# Altium project PSLink_v1.PrjPcb (part 2 of 3)

## Sheet phase-shifters.SchDoc
size 420 x 297 mm; SheetNumber: 3; SheetTotal: 7
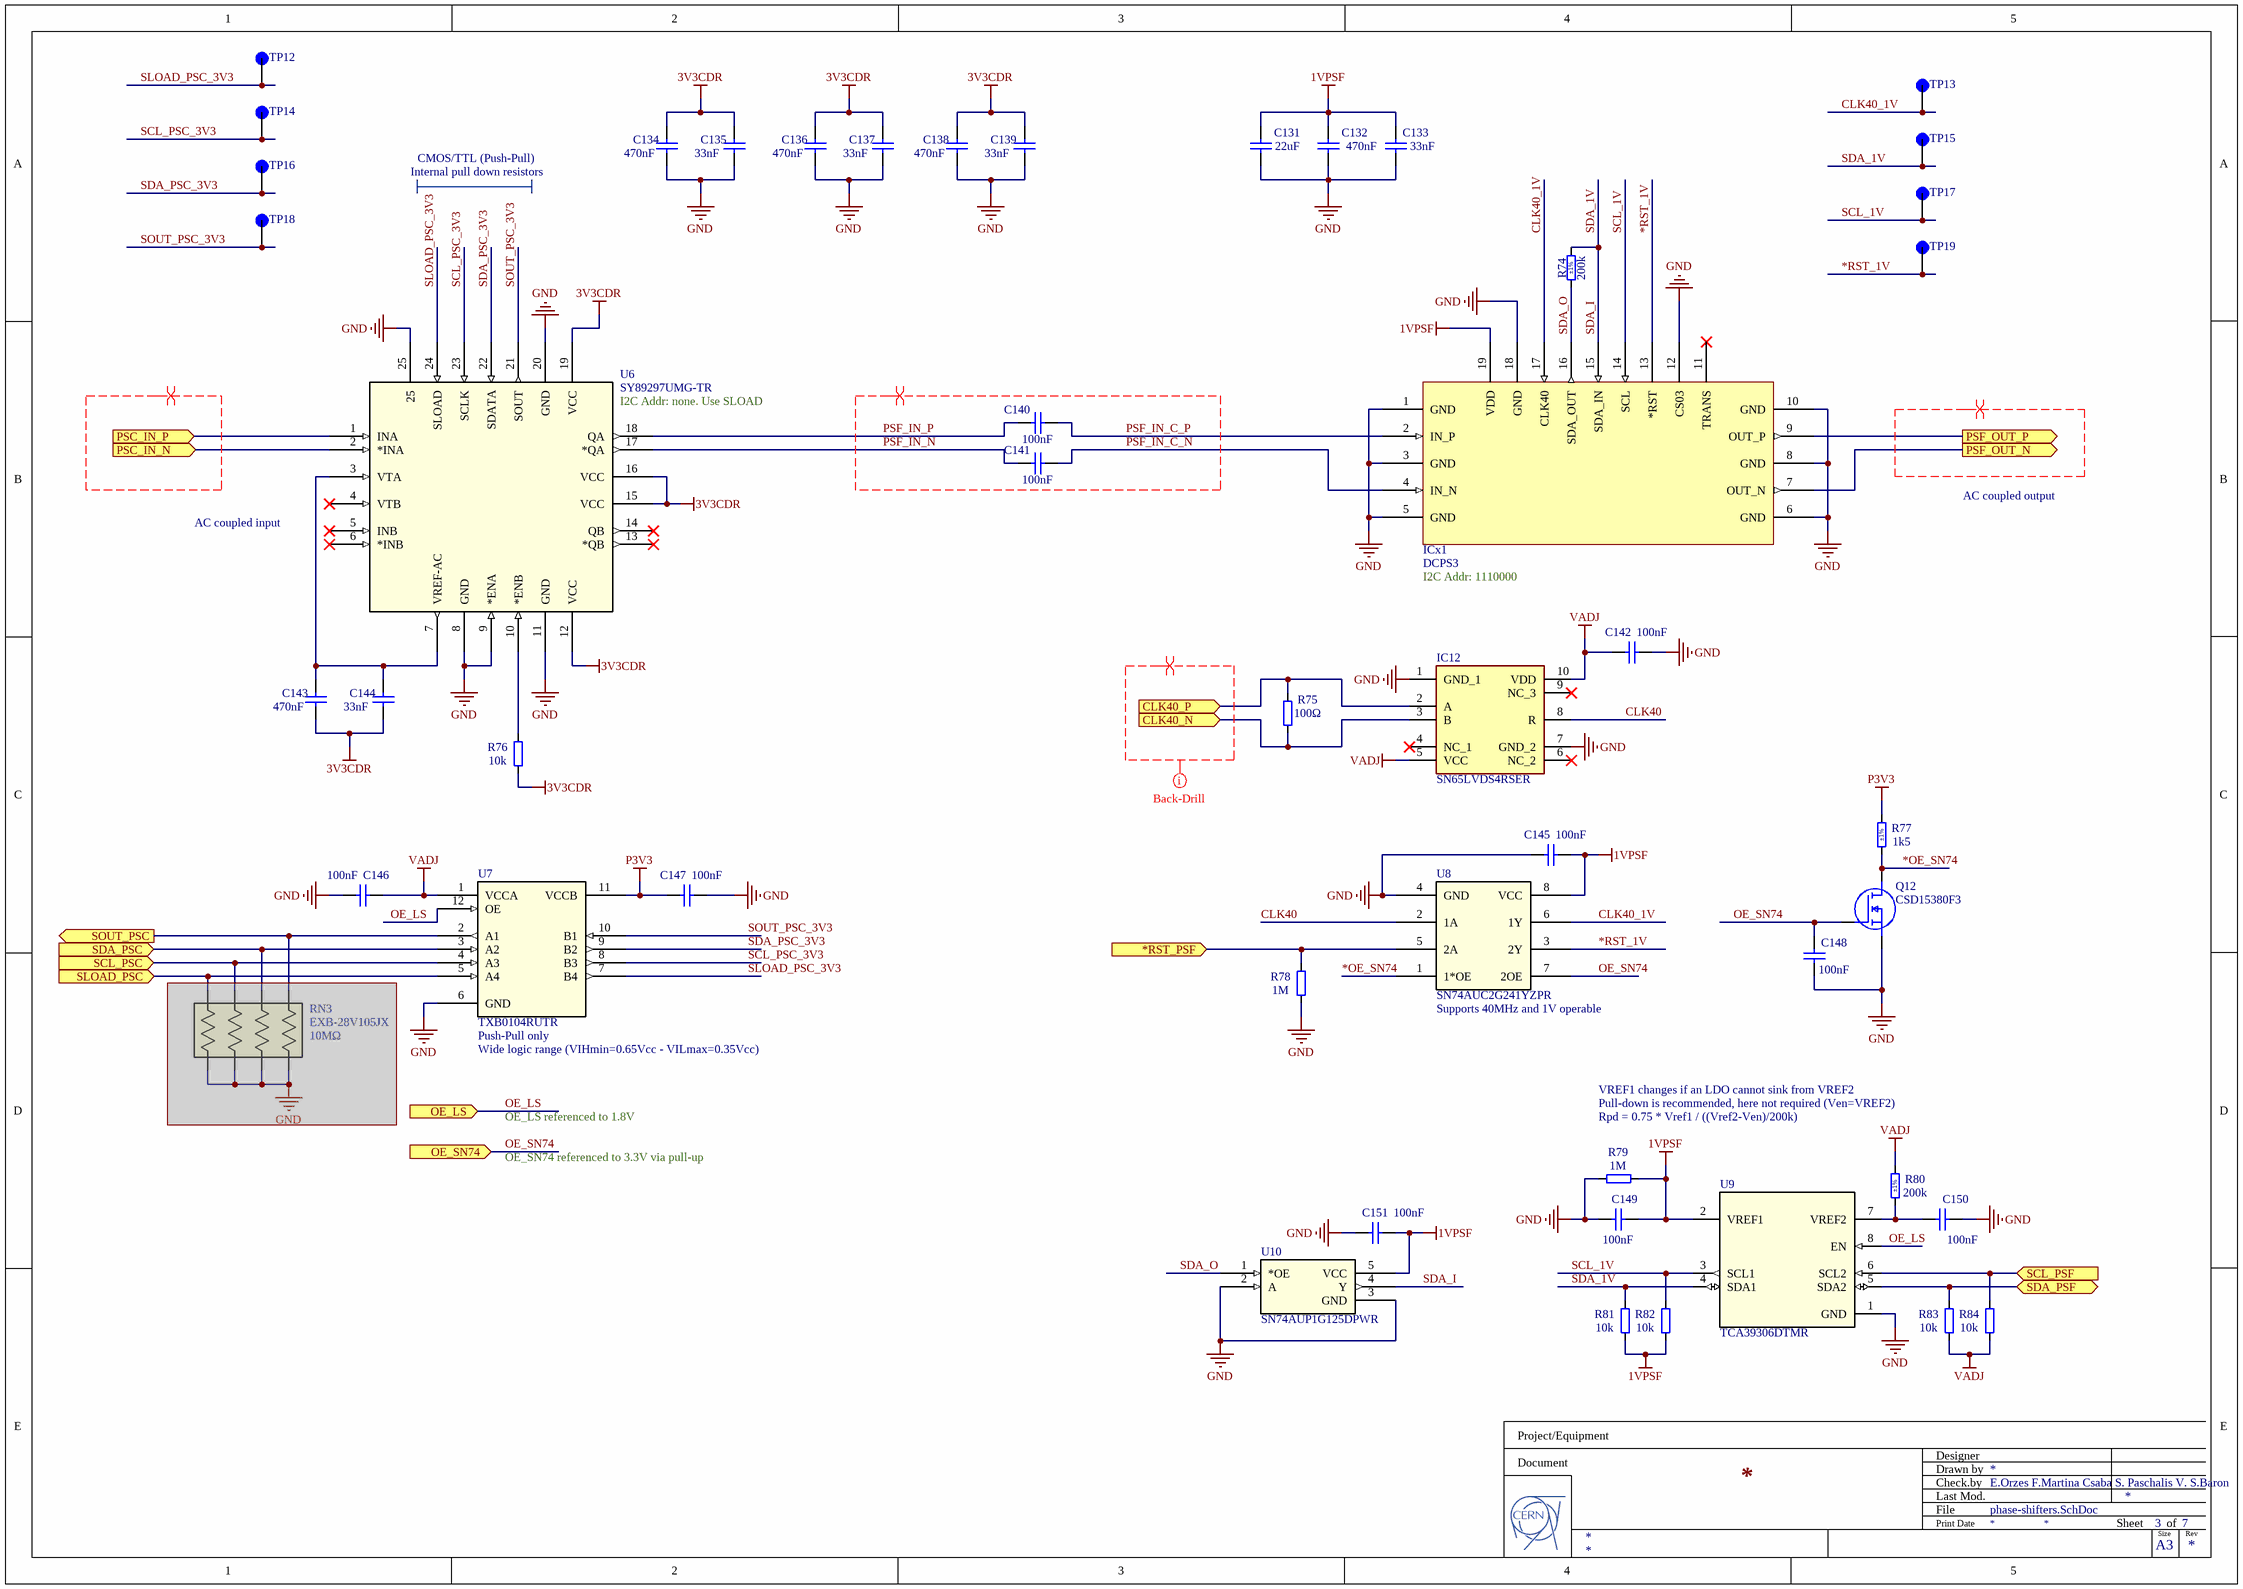
[diagram p3: phase-shifters.SchDoc]

### Parts
(Parts that share a designator on the sheet are numbered #1, #2 ... from top to bottom, then left to right.)
C131  22uF  [MURATA_HI_DENSITY_0402_CAP]
C132  470nF  [CAPC0510X04N]
C133  33nF  [LLL03TR61E333KE01]
C134  470nF  [CAPC0510X04N]
C135  33nF  [LLL03TR61E333KE01]
C136  470nF  [CAPC0510X04N]
C137  33nF  [LLL03TR61E333KE01]
C138  470nF  [CAPC0510X04N]
C139  33nF  [LLL03TR61E333KE01]
C140  100nF  [MURATA_HI_DENSITY_0201]
C141  100nF  [MURATA_HI_DENSITY_0201]
C142  100nF  [MURATA_HI_DENSITY_0201]
C143  470nF  [CAPC0510X04N]
C144  33nF  [LLL03TR61E333KE01]
C145  100nF  [MURATA_HI_DENSITY_0201]
C146  100nF  [MURATA_HI_DENSITY_0201]
C147  100nF  [MURATA_HI_DENSITY_0201]
C148  100nF  [MURATA_HI_DENSITY_0201]
C149  100nF  [MURATA_HI_DENSITY_0201]
C150  100nF  [MURATA_HI_DENSITY_0201]
C151  100nF  [MURATA_HI_DENSITY_0201]
IC12  SN65LVDS4RSER  [SN65LVDS4RSER]
ICx1  DCPS3  [DCPS3-Large]
Q12  CSD15380F3  [CSD15380F3]
R74  200k  Tolerance: ±1%  [RESC1005X40N]
R75  100Ω  [MURATA_HI_DENSITY_0201]
R76  10k  [MURATA_HI_DENSITY_0201]
R77  1k5  Tolerance: ±1%  [RESC1005X40N]
R78  1M  [MURATA_HI_DENSITY_0201]
R79  1M  [MURATA_HI_DENSITY_0201]
R80  200k  Tolerance: ±1%  [RESC1005X40N]
R81  10k  [MURATA_HI_DENSITY_0201]
R82  10k  [MURATA_HI_DENSITY_0201]
R83  10k  [MURATA_HI_DENSITY_0201]
R84  10k  [MURATA_HI_DENSITY_0201]
RN3#1  EXB-28V105JX  [EXB28V510JX]  (masked out: inside a compile mask, not in the netlist)
TP12  RCU-0C  [TP+195X110]  (value not drawn)
TP13  RCU-0C  [TP+195X110]  (value not drawn)
TP14  RCU-0C  [TP+195X110]  (value not drawn)
TP15  RCU-0C  [TP+195X110]  (value not drawn)
TP16  RCU-0C  [TP+195X110]  (value not drawn)
TP17  RCU-0C  [TP+195X110]  (value not drawn)
TP18  RCU-0C  [TP+195X110]  (value not drawn)
TP19  RCU-0C  [TP+195X110]  (value not drawn)
U6  SY89297UMG-TR  [QFN-24_MCH-L]
U7  TXB0104RUTR  [RUT12_TEX]
U8  SN74AUC2G241YZPR  [YZP8]
U9  TCA39306DTMR  [DTM0008A-MFG]
U10  SN74AUP1G125DPWR  [X2SON_TEX]

### Ports
*RST_PSF (in), CLK40_N (in), CLK40_P (in), OE_LS (in), OE_SN74 (in), PSC_IN_N (in), PSC_IN_P (in), PSF_OUT_N (out), PSF_OUT_P (out), SCL_PSC (in), SCL_PSF (in), SDA_PSC (in), SDA_PSF (bidir), SLOAD_PSC (in), SOUT_PSC (out)

### Nets
1VPSF: C131.2 C132.2 C133.2 C145.1 C149.1 C151.2 ICx1.19(VDD) R79.2 R81.1 R82.1 U8.8(VCC) U9.2(VREF1) U10.5(VCC)
3V3CDR: C134.2 C135.2 C136.2 C137.2 C138.2 C139.2 C143.1 C144.1 R76.1 U6.12(VCC) U6.15(VCC) U6.16(VCC) U6.19(VCC)
GND: C131.1 C132.1 C133.1 C134.1 C135.1 C136.1 C137.1 C138.1 C139.1 C142.1 C145.2 C146.1 C147.1 C148.2 C149.2 C150.1 C151.1 IC12.1(GND_1) IC12.7(GND_2) ICx1.1(GND) ICx1.3(GND) ICx1.5(GND) ICx1.6(GND) ICx1.8(GND) ICx1.10(GND) ICx1.12(CS03) ICx1.18(GND) Q12.2(S) R78.1 R79.1 U6.8(GND) U6.9(*ENA) U6.11(GND) U6.20(GND) U6.25 U7.6(GND) U8.4(GND) U9.1(GND) U10.2(A) U10.3(GND)
P3V3: C147.2 R77.2 U7.11(VCCB)
VADJ: C142.2 C146.2 IC12.5(VCC) IC12.10(VDD) R80.2 R83.1 R84.1 U7.1(VCCA)
*OE_SN74: Q12.3(D) R77.1 U8.1(1*OE)
*RST_1V: ICx1.13(*RST) TP19.1(TP) U8.3(2Y)
*RST_PSF: R78.2 U8.5(2A) ; port *RST_PSF
CLK40: IC12.8(R) U8.2(1A)
CLK40_1V: ICx1.17(CLK40) TP13.1(TP) U8.6(1Y)
CLK40_N: IC12.3(B) R75.1 ; port CLK40_N
CLK40_P: IC12.2(A) R75.2 ; port CLK40_P
FPGA_TX1_C_N: U6.2(*INA) ; port PSC_IN_N
FPGA_TX1_C_P: U6.1(INA) ; port PSC_IN_P
FPGA_TX1_PS_N: ICx1.7(OUT_N) ; port PSF_OUT_N
FPGA_TX1_PS_P: ICx1.9(OUT_P) ; port PSF_OUT_P
OE_LS: U7.12(OE) U9.8(EN) ; port OE_LS
OE_SN74: C148.1 Q12.1(G) U8.7(2OE) ; port OE_SN74
PSF_IN_C_N: C141.2 ICx1.4(IN_N)
PSF_IN_C_P: C140.2 ICx1.2(IN_P)
PSF_IN_N: C141.1 U6.17(*QA)
PSF_IN_P: C140.1 U6.18(QA)
SCL_1V: ICx1.14(SCL) R82.2 TP17.1(TP) U9.3(SCL1)
SCL_PSC: U7.4(A3) ; port SCL_PSC
SCL_PSC_3V3: TP14.1(TP) U6.23(SCLK) U7.8(B3)
SCL_PSF: R84.2 U9.6(SCL2) ; port SCL_PSF
SDA_1V: ICx1.15(SDA_IN) R74.2 R81.2 TP15.1(TP) U9.4(SDA1) U10.4(Y)  [also labelled SDA_I]
SDA_O: ICx1.16(SDA_OUT) R74.1 U10.1(*OE)
SDA_PSC: U7.3(A2) ; port SDA_PSC
SDA_PSC_3V3: TP16.1(TP) U6.22(SDATA) U7.9(B2)
SDA_PSF: R83.2 U9.5(SDA2) ; port SDA_PSF
SLOAD_PSC: U7.5(A4) ; port SLOAD_PSC
SLOAD_PSC_3V3: TP12.1(TP) U6.24(SLOAD) U7.7(B4)
SOUT_PSC: U7.2(A1) ; port SOUT_PSC
SOUT_PSC_3V3: TP18.1(TP) U6.21(SOUT) U7.10(B1)
NetC143_2: C143.2 C144.2 U6.3(VTA) U6.7(VREF-AC)
NetC150_2: C150.2 R80.1 U9.7(VREF2)
NetR76_2: R76.2 U6.10(*ENB)

Not connected (* = marked no-connect by the designer): IC12 4(NC_1)* 6(NC_2)* 9(NC_3)*; ICx1 11(TRANS)*; U6 4(VTB)* 5(INB)* 6(*INB)* 13(*QB)* 14(QB)*

### Layout directives
differential pair: (no net found under the mark), PSF_IN_C_N, PSF_IN_C_P, PSF_IN_N, PSF_IN_P
net class Back-Drill: (no net found under the mark)

### Notes on the sheet
- Internal pull down resistors
- CMOS/TTL (Push-Pull)
- (near U6) I2C Addr: none. Use SLOAD
- AC coupled input
- AC coupled output
- I2C Addr: 1110000
- (near RN3#1) 10MΩ
- (near U7) Push-Pull only
- (near U7) Wide logic range (VIHmin=0.65Vcc - VILmax=0.35Vcc)
- (near U8) Supports 40MHz and 1V operable
- OE_LS referenced to 1.8V
- Rpd = 0.75 * Vref1 / ((Vref2-Ven)/200k)
- VREF1 changes if an LDO cannot sink from VREF2
- Pull-down is recommended, here not required (Ven=VREF2)
- OE_SN74 referenced to 3.3V via pull-up
- Project/Equipment
- Document
- Designer
- Drawn by
- Check.by
- File
- Last Mod.
- Print Date
- Sheet
- Size
- A3
- of
- Rev

### Library data of the parts
C131 = C0402-22uF-high-density: GRM155R60J226ME11; Vmax: 6.3V; Value: 22uF
C132 C134 C136 C138 C143 = Capacitor - non polarized: LLL153C70G474ME17; Value: 470nF
C133 C135 C137 C139 C144 = Capacitor - non polarized: LLL03TR61E333KE01; Value: 33nF
C140-C142 C145-C151 = C0201-100nF-high-density: GRM033R61C104KE14; Vmax: 16V; Value: 100nF
IC12 = SN65LVDS4RSER: Integrated Circuit; Manufacturer_Name: Texas Instruments; Datasheet Link: http://www.ti.com/lit/gpn/SN65LVDS4; Height: 0.6mm; Manufacturer_Part_Number: SN65LVDS4RSER; Mouser Part Number: 595-SN65LVDS4RSER; Mouser Price/Stock: https://www.mouser.co.uk/ProductDetail/Texas-Instruments/SN65LVDS4RSER?qs=kO%2FAGeZgcF8xT3dfx7gx%252Bg%3D%3D; Arrow Part Number: SN65LVDS4RSER; Arrow Price/Stock: https://www.arrow.com/en/products/sn65lvds4rser/texas-instruments
Q12 = CSD15380F3: as Q1 on sheet power-sheet; Datasheet Link: https://www.ti.com/lit/ds/symlink/csd15380f3.pdf?ts=1641221366106&ref_url=https%253A%252F%252Fwww.google.com%252F; Height: 0.35mm; Manufacturer_Part_Number: CSD15380F3; Mouser Part Number: 595-CSD15380F3; Mouser Price/Stock: https://www.mouser.co.uk/ProductDetail/Texas-Instruments/CSD15380F3?qs=zEmsApcVOkXP46xhm0edmA%3D%3D; Arrow Part Number: CSD15380F3; Arrow Price/Stock: https://www.arrow.com/en/products/csd15380f3/texas-instruments?region=nac
R74 R80 = R0402_200K_1%_0.0625W_100PPM: as R24 on sheet power-sheet; Part Number: R0402_200K_1%_0.0625W_100PPM; Component Kind: Standard; Component Type: Standard; Pin Count: 2; Value: 200k; Status: Not Recommended; Power: 0.0625W; Manufacturer Part Number: R0402_200K_1%_0.0625W_100PPM; Case: 0402; Mounted: Yes; Sense: No; Socket: No; SMD: Yes; Manufacturer1 Example: YAGEO PHYCOMP; Manufacturer1 ComponentHeight: 0.4mm; HelpURL: \\cern.ch\dfs\Applications\Altium\Datasheets\R0402_Phycomp_RC0402.pdf; Author: CERN DEM JLC; CreateDate: 12/3/2007; LatestRevisionDate: 10/17/2012
R75 = R0201-100ohm-high-density: Resistor; Value: 100Ω
R76 R81-R84 = R0201-100ohm-high-density: Resistor 10k; Value: 100Ω
R77 = R0402_1K5_1%_0.0625W_100PPM: Resistor - 1%; Part Description: General Purpose Thick Film Chip Resistor; Manufacturer: GENERIC; Manufacturer1 Part Number: 232270671502L; TC: ±100ppm/°C; PressFit: No; Part Number: R0402_1K5_1%_0.0625W_100PPM; Component Kind: Standard; Component Type: Standard; Pin Count: 2; Value: 1k5; Status: Not Recommended; Power: 0.0625W; Manufacturer Part Number: R0402_1K5_1%_0.0625W_100PPM; Case: 0402; Mounted: Yes; Sense: No; Socket: No; SMD: Yes; Manufacturer1 Example: YAGEO PHYCOMP; Manufacturer1 ComponentHeight: 0.4mm; HelpURL: \\cern.ch\dfs\Applications\Altium\Datasheets\R0402_Phycomp_RC0402.pdf; Author: CERN DEM JLC; CreateDate: 12/3/2007; LatestRevisionDate: 10/17/2012
R78 R79 = R0201-100ohm-high-density: Resistor 1M; Value: 100Ω
RN3#1 = EXB-28V105JX: Resistor Network; Manufacturer_Name: Panasonic; Datasheet Link: https://componentsearchengine.com/Datasheets/1/EXB-28V105JX.pdf; Height: 0mm; Manufacturer_Part_Number: EXB-28V105JX; Mouser Part Number: 667-EXB-28V105JX; Mouser Price/Stock: https://www.mouser.co.uk/ProductDetail/Panasonic/EXB-28V105JX?qs=cttFivMKqWzpuYBrjCbkjA%3D%3D; Arrow Part Number: EXB-28V105JX; Arrow Price/Stock: https://www.arrow.com/en/products/exb-28v105jx/panasonic
TP12-TP19 = RCU-0C: as TP1 on sheet lane; Package: None; Price: None; Value: *; MP: RCU-0C; Availability: Unavailable
U6 = SY89297UMG-TR: Coarse Phase Shifter (5ps/5ns); Mfr_Name: Microchip; RefDes: RefDes; Type: Type
U7 = TXB0104RUTR: No Description Available; Mfr_Name: Texas Instruments; RefDes: RefDes; Type: Type
U8 = SN74AUC2G241YZPR: No Description Available; Mfr_Name: Texas Instruments; RefDes: RefDes; Type: Type
U9 = TCA39306DTMR: No Description Available; Mfr_Name: Texas Instruments; TYPE: TYPE; RefDes: RefDes
U10 = SN74AUP1G125DPWR: No Description Available; Mfr_Name: Texas Instruments; RefDes: RefDes; Type: Type

## Sheet SFP.SchDoc
size 420 x 297 mm; SheetNumber: 4; SheetTotal: 7
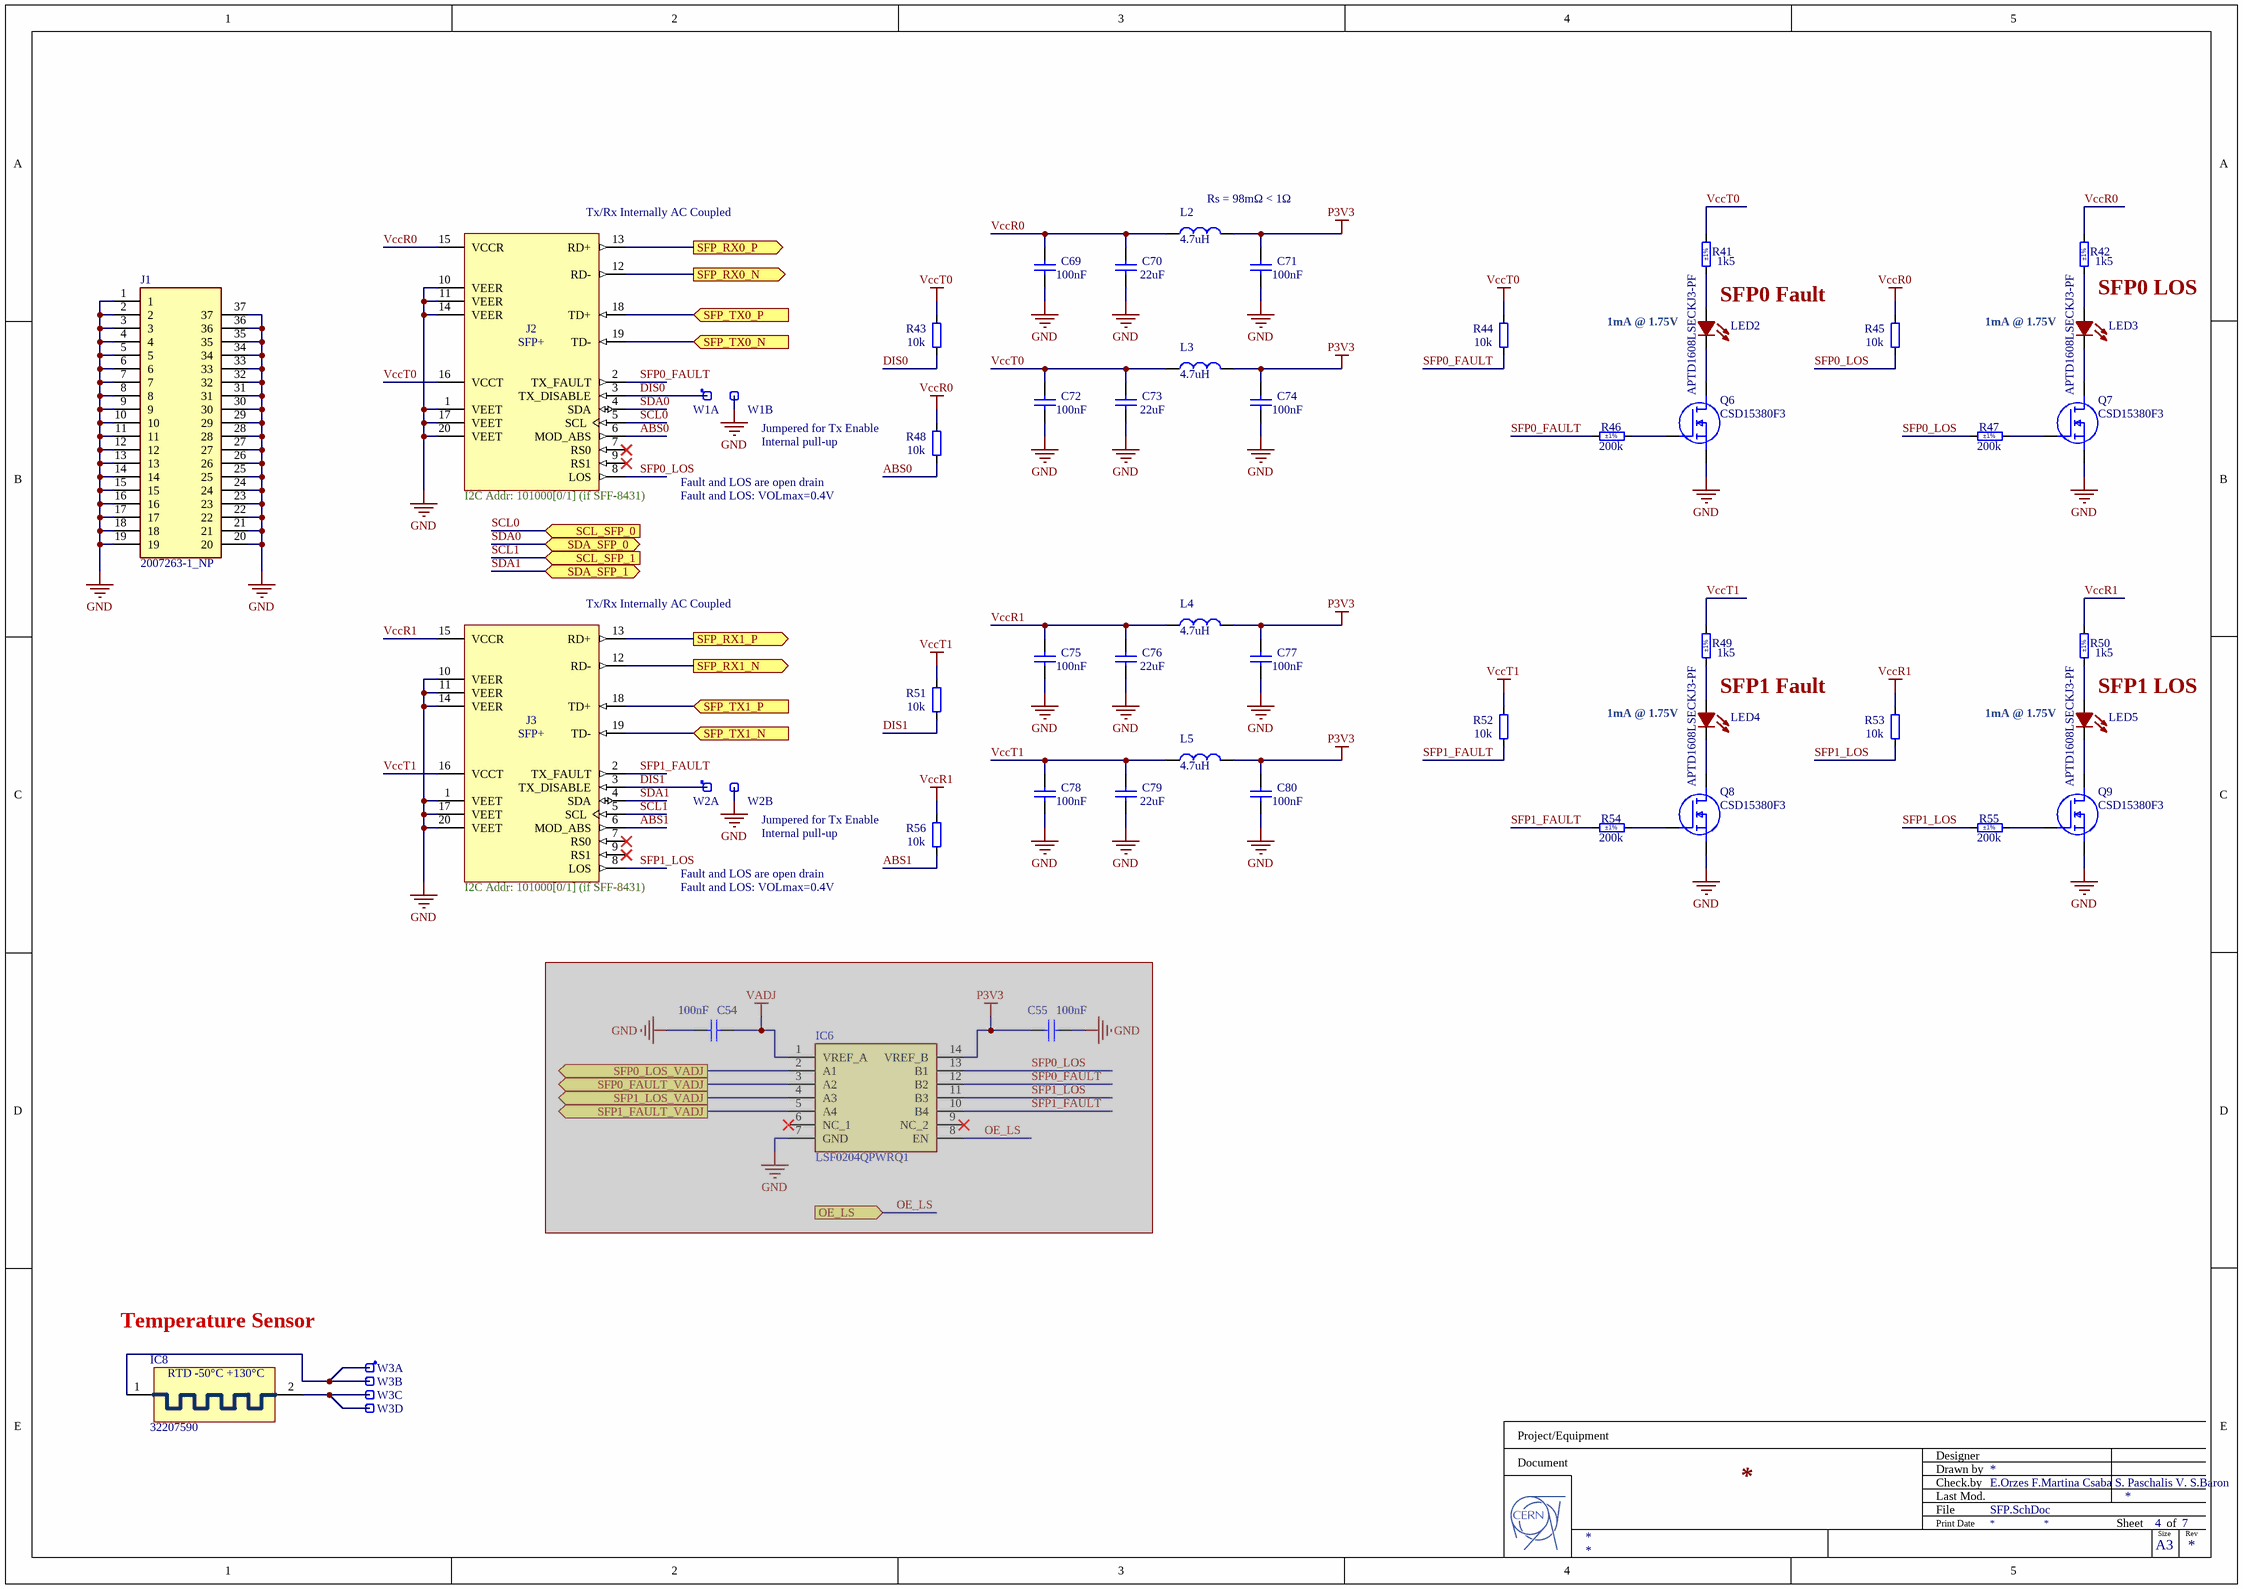
[diagram p4: SFP.SchDoc]

### Parts
(Parts that share a designator on the sheet are numbered #1, #2 ... from top to bottom, then left to right.)
C54#2  100nF  [MURATA_HI_DENSITY_0201]  (masked out: inside a compile mask, not in the netlist)
C55#2  100nF  [MURATA_HI_DENSITY_0201]  (masked out: inside a compile mask, not in the netlist)
C69  100nF  [MURATA_HI_DENSITY_0201]
C70  22uF  [MURATA_HI_DENSITY_0402_CAP]
C71  100nF  [MURATA_HI_DENSITY_0201]
C72  100nF  [MURATA_HI_DENSITY_0201]
C73  22uF  [MURATA_HI_DENSITY_0402_CAP]
C74  100nF  [MURATA_HI_DENSITY_0201]
C75  100nF  [MURATA_HI_DENSITY_0201]
C76  22uF  [MURATA_HI_DENSITY_0402_CAP]
C77  100nF  [MURATA_HI_DENSITY_0201]
C78  100nF  [MURATA_HI_DENSITY_0201]
C79  22uF  [MURATA_HI_DENSITY_0402_CAP]
C80  100nF  [MURATA_HI_DENSITY_0201]
IC6#2  LSF0204QPWRQ1  [SOP65P640X120-14N]  (masked out: inside a compile mask, not in the netlist)
IC8  32207590  [PT100]
J1  2007263-1_NP  [20072631_NP]
J2  SFP+  [TYCO_1888247-1]
J3  SFP+  [TYCO_1888247-1]
L2  4.7uH  [DFE322520FD1R0MP2]
L3  4.7uH  [DFE322520FD1R0MP2]
L4  4.7uH  [DFE322520FD1R0MP2]
L5  4.7uH  [DFE322520FD1R0MP2]
LED2  APTD1608LSECKJ3-PF  [LED_APTD1608LSECKJ3-PF_KNB]
LED3  APTD1608LSECKJ3-PF  [LED_APTD1608LSECKJ3-PF_KNB]
LED4  APTD1608LSECKJ3-PF  [LED_APTD1608LSECKJ3-PF_KNB]
LED5  APTD1608LSECKJ3-PF  [LED_APTD1608LSECKJ3-PF_KNB]
Q6  CSD15380F3  [CSD15380F3]
Q7  CSD15380F3  [CSD15380F3]
Q8  CSD15380F3  [CSD15380F3]
Q9  CSD15380F3  [CSD15380F3]
R41  1k5  Tolerance: ±1%  [RESC1005X40N]
R42  1k5  Tolerance: ±1%  [RESC1005X40N]
R43  10k  [MURATA_HI_DENSITY_0201]
R44  10k  [MURATA_HI_DENSITY_0201]
R45  10k  [MURATA_HI_DENSITY_0201]
R46  200k  Tolerance: ±1%  [RESC1005X40N]
R47  200k  Tolerance: ±1%  [RESC1005X40N]
R48  10k  [MURATA_HI_DENSITY_0201]
R49  1k5  Tolerance: ±1%  [RESC1005X40N]
R50  1k5  Tolerance: ±1%  [RESC1005X40N]
R51  10k  [MURATA_HI_DENSITY_0201]
R52  10k  [MURATA_HI_DENSITY_0201]
R53  10k  [MURATA_HI_DENSITY_0201]
R54  200k  Tolerance: ±1%  [RESC1005X40N]
R55  200k  Tolerance: ±1%  [RESC1005X40N]
R56  10k  [MURATA_HI_DENSITY_0201]
W1  Header 2  [SAMTEC_HTSW-102-23-L-S]  (value not drawn)  (parts A,B of 2)
W2  Header 2  [SAMTEC_HTSW-102-23-L-S]  (value not drawn)  (parts A,B of 2)
W3  Header 4  [SAMTEC_HTSW-104-23-L-S]  (value not drawn)  (parts A,B,C,D of 4)

### Ports
OE_LS (in), SCL_SFP_0 (in), SCL_SFP_1 (in), SDA_SFP_0 (bidir), SDA_SFP_1 (bidir), SFP0_FAULT_VADJ (out), SFP0_LOS_VADJ (out), SFP1_FAULT_VADJ (out), SFP1_LOS_VADJ (out), SFP_RX0_N (out), SFP_RX0_P (out), SFP_RX1_N (out), SFP_RX1_P (out), SFP_TX0_N (in), SFP_TX0_P (in), SFP_TX1_N (in), SFP_TX1_P (in)

### Nets
GND: C69.1 C70.1 C71.1 C72.1 C73.1 C74.1 C75.1 C76.1 C77.1 C78.1 C79.1 C80.1 J1.1 J1.2 J1.3 J1.4 J1.5 J1.6 J1.7 J1.8 J1.9 J1.10 J1.11 J1.12 J1.13 J1.14 J1.15 J1.16 J1.17 J1.18 J1.19 J1.20 J1.21 J1.22 J1.23 J1.24 J1.25 J1.26 J1.27 J1.28 J1.29 J1.30 J1.31 J1.32 J1.33 J1.34 J1.35 J1.36 J1.37 J2.1(VEET) J2.10(VEER) J2.11(VEER) J2.14(VEER) J2.17(VEET) J2.20(VEET) J3.1(VEET) J3.10(VEER) J3.11(VEER) J3.14(VEER) J3.17(VEET) J3.20(VEET) Q6.2(S) Q7.2(S) Q8.2(S) Q9.2(S) W1.2 W2.2
P3V3: C71.2 C74.2 C77.2 C80.2 L2.2 L3.2 L4.2 L5.2
VccR0: C69.2 C70.2 J2.15(VCCR) L2.1 R42.2 R45.2 R48.2
VccR1: C75.2 C76.2 J3.15(VCCR) L4.1 R50.2 R53.2 R56.2
VccT0: C72.2 C73.2 J2.16(VCCT) L3.1 R41.2 R43.2 R44.2
VccT1: C78.2 C79.2 J3.16(VCCT) L5.1 R49.2 R51.2 R52.2
ABS0: J2.6(MOD_ABS) R48.1
ABS1: J3.6(MOD_ABS) R56.1
DIS0: J2.3(TX_DISABLE) R43.1 W1.1
DIS1: J3.3(TX_DISABLE) R51.1 W2.1
SCL0: J2.5(SCL) ; port SCL_SFP_0
SCL1: J3.5(SCL) ; port SCL_SFP_1
SDA0: J2.4(SDA) ; port SDA_SFP_0
SDA1: J3.4(SDA) ; port SDA_SFP_1
SFP0_FAULT: J2.2(TX_FAULT) R44.1 R46.1
SFP0_LOS: J2.8(LOS) R45.1 R47.1
SFP1_FAULT: J3.2(TX_FAULT) R52.1 R54.1
SFP1_LOS: J3.8(LOS) R53.1 R55.1
SFP_RX0_N: J2.12(RD-) ; port SFP_RX0_N
SFP_RX0_P: J2.13(RD+) ; port SFP_RX0_P
SFP_RX1_N: J3.12(RD-) ; port SFP_RX1_N
SFP_RX1_P: J3.13(RD+) ; port SFP_RX1_P
SFP_TX0_N: J2.19(TD-) ; port SFP_TX0_N
SFP_TX0_P: J2.18(TD+) ; port SFP_TX0_P
SFP_TX1_N: J3.19(TD-) ; port SFP_TX1_N
SFP_TX1_P: J3.18(TD+) ; port SFP_TX1_P
NetIC8_1: IC8.1 W3.1 W3.2
NetIC8_2: IC8.2 W3.3 W3.4
NetLED2_1: LED2.1(C) Q6.3(D)
NetLED2_2: LED2.2(A) R41.1
NetLED3_1: LED3.1(C) Q7.3(D)
NetLED3_2: LED3.2(A) R42.1
NetLED4_1: LED4.1(C) Q8.3(D)
NetLED4_2: LED4.2(A) R49.1
NetLED5_1: LED5.1(C) Q9.3(D)
NetLED5_2: LED5.2(A) R50.1
NetQ6_1: Q6.1(G) R46.2
NetQ7_1: Q7.1(G) R47.2
NetQ8_1: Q8.1(G) R54.2
NetQ9_1: Q9.1(G) R55.2

Not connected (* = marked no-connect by the designer): J2 7(RS0)* 9(RS1)*; J3 7(RS0)* 9(RS1)*

### Notes on the sheet
- (near J2) Tx/Rx Internally AC Coupled
- (near L2) Rs = 98mΩ < 1Ω
- (near LED2) 1mA @ 1.75V
- SFP0 Fault
- (near LED3) 1mA @ 1.75V
- SFP0 LOS
- Jumpered for Tx Enable
- (near W1) Internal pull-up
- (near J2) I2C Addr: 101000[0/1] (if SFF-8431)
- Fault and LOS are open drain
- Fault and LOS: VOLmax=0.4V
- (near J3) Tx/Rx Internally AC Coupled
- (near LED4) 1mA @ 1.75V
- SFP1 Fault
- (near LED5) 1mA @ 1.75V
- SFP1 LOS
- (near W2) Internal pull-up
- (near J3) I2C Addr: 101000[0/1] (if SFF-8431)
- Temperature Sensor
- Project/Equipment
- Document
- Designer
- Drawn by
- Check.by
- File
- Last Mod.
- Print Date
- Sheet
- Size
- A3
- of
- Rev
- (in symbol PT100) RTD; -50°C +130°C

### Library data of the parts
C54#2 C55#2 C69 C71 C72 C74 C75 C77 C78 C80 = C0201-100nF-high-density: GRM033R61C104KE14; Vmax: 16V; Value: 100nF
C70 C73 C76 C79 = C0402-22uF-high-density: GRM155R60J226ME11; Vmax: 6.3V; Value: 22uF
IC6#2 = LSF0204QPWRQ1: Integrated Circuit; Manufacturer_Name: Texas Instruments; Datasheet Link: http://www.ti.com/lit/gpn/lsf0204-q1; Height: 1.2mm; Manufacturer_Part_Number: LSF0204QPWRQ1; Mouser Part Number: 595-LSF0204QPWRQ1; Mouser Price/Stock: https://www.mouser.co.uk/ProductDetail/Texas-Instruments/LSF0204QPWRQ1?qs=w%2Fv1CP2dgqqt88p%2F1xId1A%3D%3D; Arrow Part Number: LSF0204QPWRQ1; Arrow Price/Stock: https://www.arrow.com/en/products/lsf0204qpwrq1/texas-instruments?region=nac
IC8 = PT100: 32207590 - PT100 - 1206 - 0.3degC - -50/130
J1 = 2007263-1_NP: Connector; Manufacturer_Name: TE Connectivity; Datasheet Link: https://www.te.com/commerce/DocumentDelivery/DDEController?Action=srchrtrv&DocNm=4-1773455-3_Quick_Ref_Guide_SFP%2B_Sol&DocType=Data%20Sheet&DocLang=English&PartCntxt=2007263-1&DocFormat=pdf; Height: 9.8mm; Manufacturer_Part_Number: 2007263-1; Mouser Part Number: 571-2007263-1; Mouser Price/Stock: https://www.mouser.co.uk/ProductDetail/TE-Connectivity/2007263-1?qs=4zF2lffhceF8GItBX4M8mw%3D%3D; Arrow Part Number: 2007263-1; Arrow Price/Stock: https://www.arrow.com/en/products/2007263-1/te-connectivity?region=europe
J2 J3 = TYCO_1888247-1: 20 Position SFP+ Connector (Small Form-factor Pluggable); Part Description: 20 Position, Pitch 0.8mm SFP+ Receptacle (Small Form-factor Pluggable); Manufacturer: TYCO ELECTRONICS; PressFit: No; Part Number: TYCO_1888247-1; Component Kind: Standard; Component Type: Standard; Pin Count: 20; Family: SFP+; Mounted: Yes; Socket: No; SMD: Yes; Sense: No; Status: None; Manufacturer Part Number: 1888247-1; ComponentHeight: 5.4mm; HelpURL: \\cern.ch\dfs\Applications\Altium\Datasheets\TYCO_1888247-1.pdf; Author: CERN DEM JLC; CreateDate: 2/27/2012; LatestRevisionDate: 2/27/2012
L2-L5 = DFE322520FD-4R7M=P2: Inductor; Manufacturer_Name: Murata Electronics; Datasheet Link: https://search.murata.co.jp/Ceramy/image/img/P02/J(E)TE243A-9104.pdf; Height: 2mm; Manufacturer_Part_Number: DFE322520FD-4R7M=P2; Mouser Part Number: 81-DFE322520FD4R7MP2; Mouser Price/Stock: https://www.mouser.co.uk/ProductDetail/Murata-Electronics/DFE322520FD-4R7M%3dP2?qs=17u8i%2FzlE8%252BgAY54mivQ1g%3D%3D; Arrow Part Number: DFE322520FD-4R7M=P2; Arrow Price/Stock: https://www.arrow.com/en/products/dfe322520fd-4r7mp2/murata-manufacturing?region=nac
LED2-LED5 = APTD1608LSECKJ3-PF: Led Red 0603 2mA 1.8V 50mcd 84mW; Mfr_Name: Kingbright
Q6-Q9 = CSD15380F3: as Q1 on sheet power-sheet; Datasheet Link: https://www.ti.com/lit/ds/symlink/csd15380f3.pdf?ts=1641221366106&ref_url=https%253A%252F%252Fwww.google.com%252F; Height: 0.35mm; Manufacturer_Part_Number: CSD15380F3; Mouser Part Number: 595-CSD15380F3; Mouser Price/Stock: https://www.mouser.co.uk/ProductDetail/Texas-Instruments/CSD15380F3?qs=zEmsApcVOkXP46xhm0edmA%3D%3D; Arrow Part Number: CSD15380F3; Arrow Price/Stock: https://www.arrow.com/en/products/csd15380f3/texas-instruments?region=nac
R41 R42 R49 R50 = R0402_1K5_1%_0.0625W_100PPM: as R77 on sheet phase-shifters; Part Number: R0402_1K5_1%_0.0625W_100PPM; Component Kind: Standard; Component Type: Standard; Pin Count: 2; Value: 1k5; Status: Not Recommended; Power: 0.0625W; Manufacturer Part Number: R0402_1K5_1%_0.0625W_100PPM; Case: 0402; Mounted: Yes; Sense: No; Socket: No; SMD: Yes; Manufacturer1 Example: YAGEO PHYCOMP; Manufacturer1 ComponentHeight: 0.4mm; HelpURL: \\cern.ch\dfs\Applications\Altium\Datasheets\R0402_Phycomp_RC0402.pdf; Author: CERN DEM JLC; CreateDate: 12/3/2007; LatestRevisionDate: 10/17/2012
R43-R45 R48 R51-R53 R56 = R0201-100ohm-high-density: Resistor 10k; Value: 100Ω
R46 R47 R54 R55 = R0402_200K_1%_0.0625W_100PPM: as R24 on sheet power-sheet; Part Number: R0402_200K_1%_0.0625W_100PPM; Component Kind: Standard; Component Type: Standard; Pin Count: 2; Value: 200k; Status: Not Recommended; Power: 0.0625W; Manufacturer Part Number: R0402_200K_1%_0.0625W_100PPM; Case: 0402; Mounted: Yes; Sense: No; Socket: No; SMD: Yes; Manufacturer1 Example: YAGEO PHYCOMP; Manufacturer1 ComponentHeight: 0.4mm; HelpURL: \\cern.ch\dfs\Applications\Altium\Datasheets\R0402_Phycomp_RC0402.pdf; Author: CERN DEM JLC; CreateDate: 12/3/2007; LatestRevisionDate: 10/17/2012
W1 W2 = SAMTEC_HTSW-102-23-L-S: 2 Mini Wire-Wrap Contact Strip Header; Part Description: 2 Contacts, Pitch 2.54mm, Single Row  Through Mount Straight Header (Post Lead 5.84mm, Tail Lead 2.92mm, Insulator 2.54mm); Manufacturer: SAMTEC; PressFit: No; Status Comment: High Temperature; Part Number: SAMTEC_HTSW-102-23-L-S; Component Kind: Standard; Component Type: Standard; Pin Count: 2; Family: Header 2; Mounted: Yes; Socket: No; SMD: No; Sense: No; Status: Preferred; Manufacturer Part Number: HTSW-102-23-L-S; ComponentHeight: 8.38mm; HelpURL: \\cern.ch\dfs\Applications\Altium\Datasheets\SAMTEC_HTSW-102-23-L-S.pdf; Author: CERN DEM JLC; CreateDate: 2/22/2018; LatestRevisionDate: 2/22/2018
W3 = SAMTEC_HTSW-104-23-L-S: 4 Mini Wire-Wrap Contact Strip Header; Part Description: 4 Contacts, Pitch 2.54mm, Single Row  Through Mount Straight Header (Post Lead 5.84mm, Tail Lead 2.92mm, Insulator 2.54mm); Manufacturer: SAMTEC; PressFit: No; Status Comment: High Temperature; Part Number: SAMTEC_HTSW-104-23-L-S; Component Kind: Standard; Component Type: Standard; Pin Count: 4; Family: Header 4; Mounted: Yes; Socket: No; SMD: No; Sense: No; Status: Preferred; Manufacturer Part Number: HTSW-104-23-L-S; ComponentHeight: 8.38mm; HelpURL: \\cern.ch\dfs\Applications\Altium\Datasheets\SAMTEC_HTSW-104-23-L-S.pdf; Author: CERN DEM JLC; CreateDate: 2/22/2018; LatestRevisionDate: 2/22/2018

## Sheet PLL.SchDoc
size 420 x 297 mm; SheetNumber: 6; SheetTotal: 7
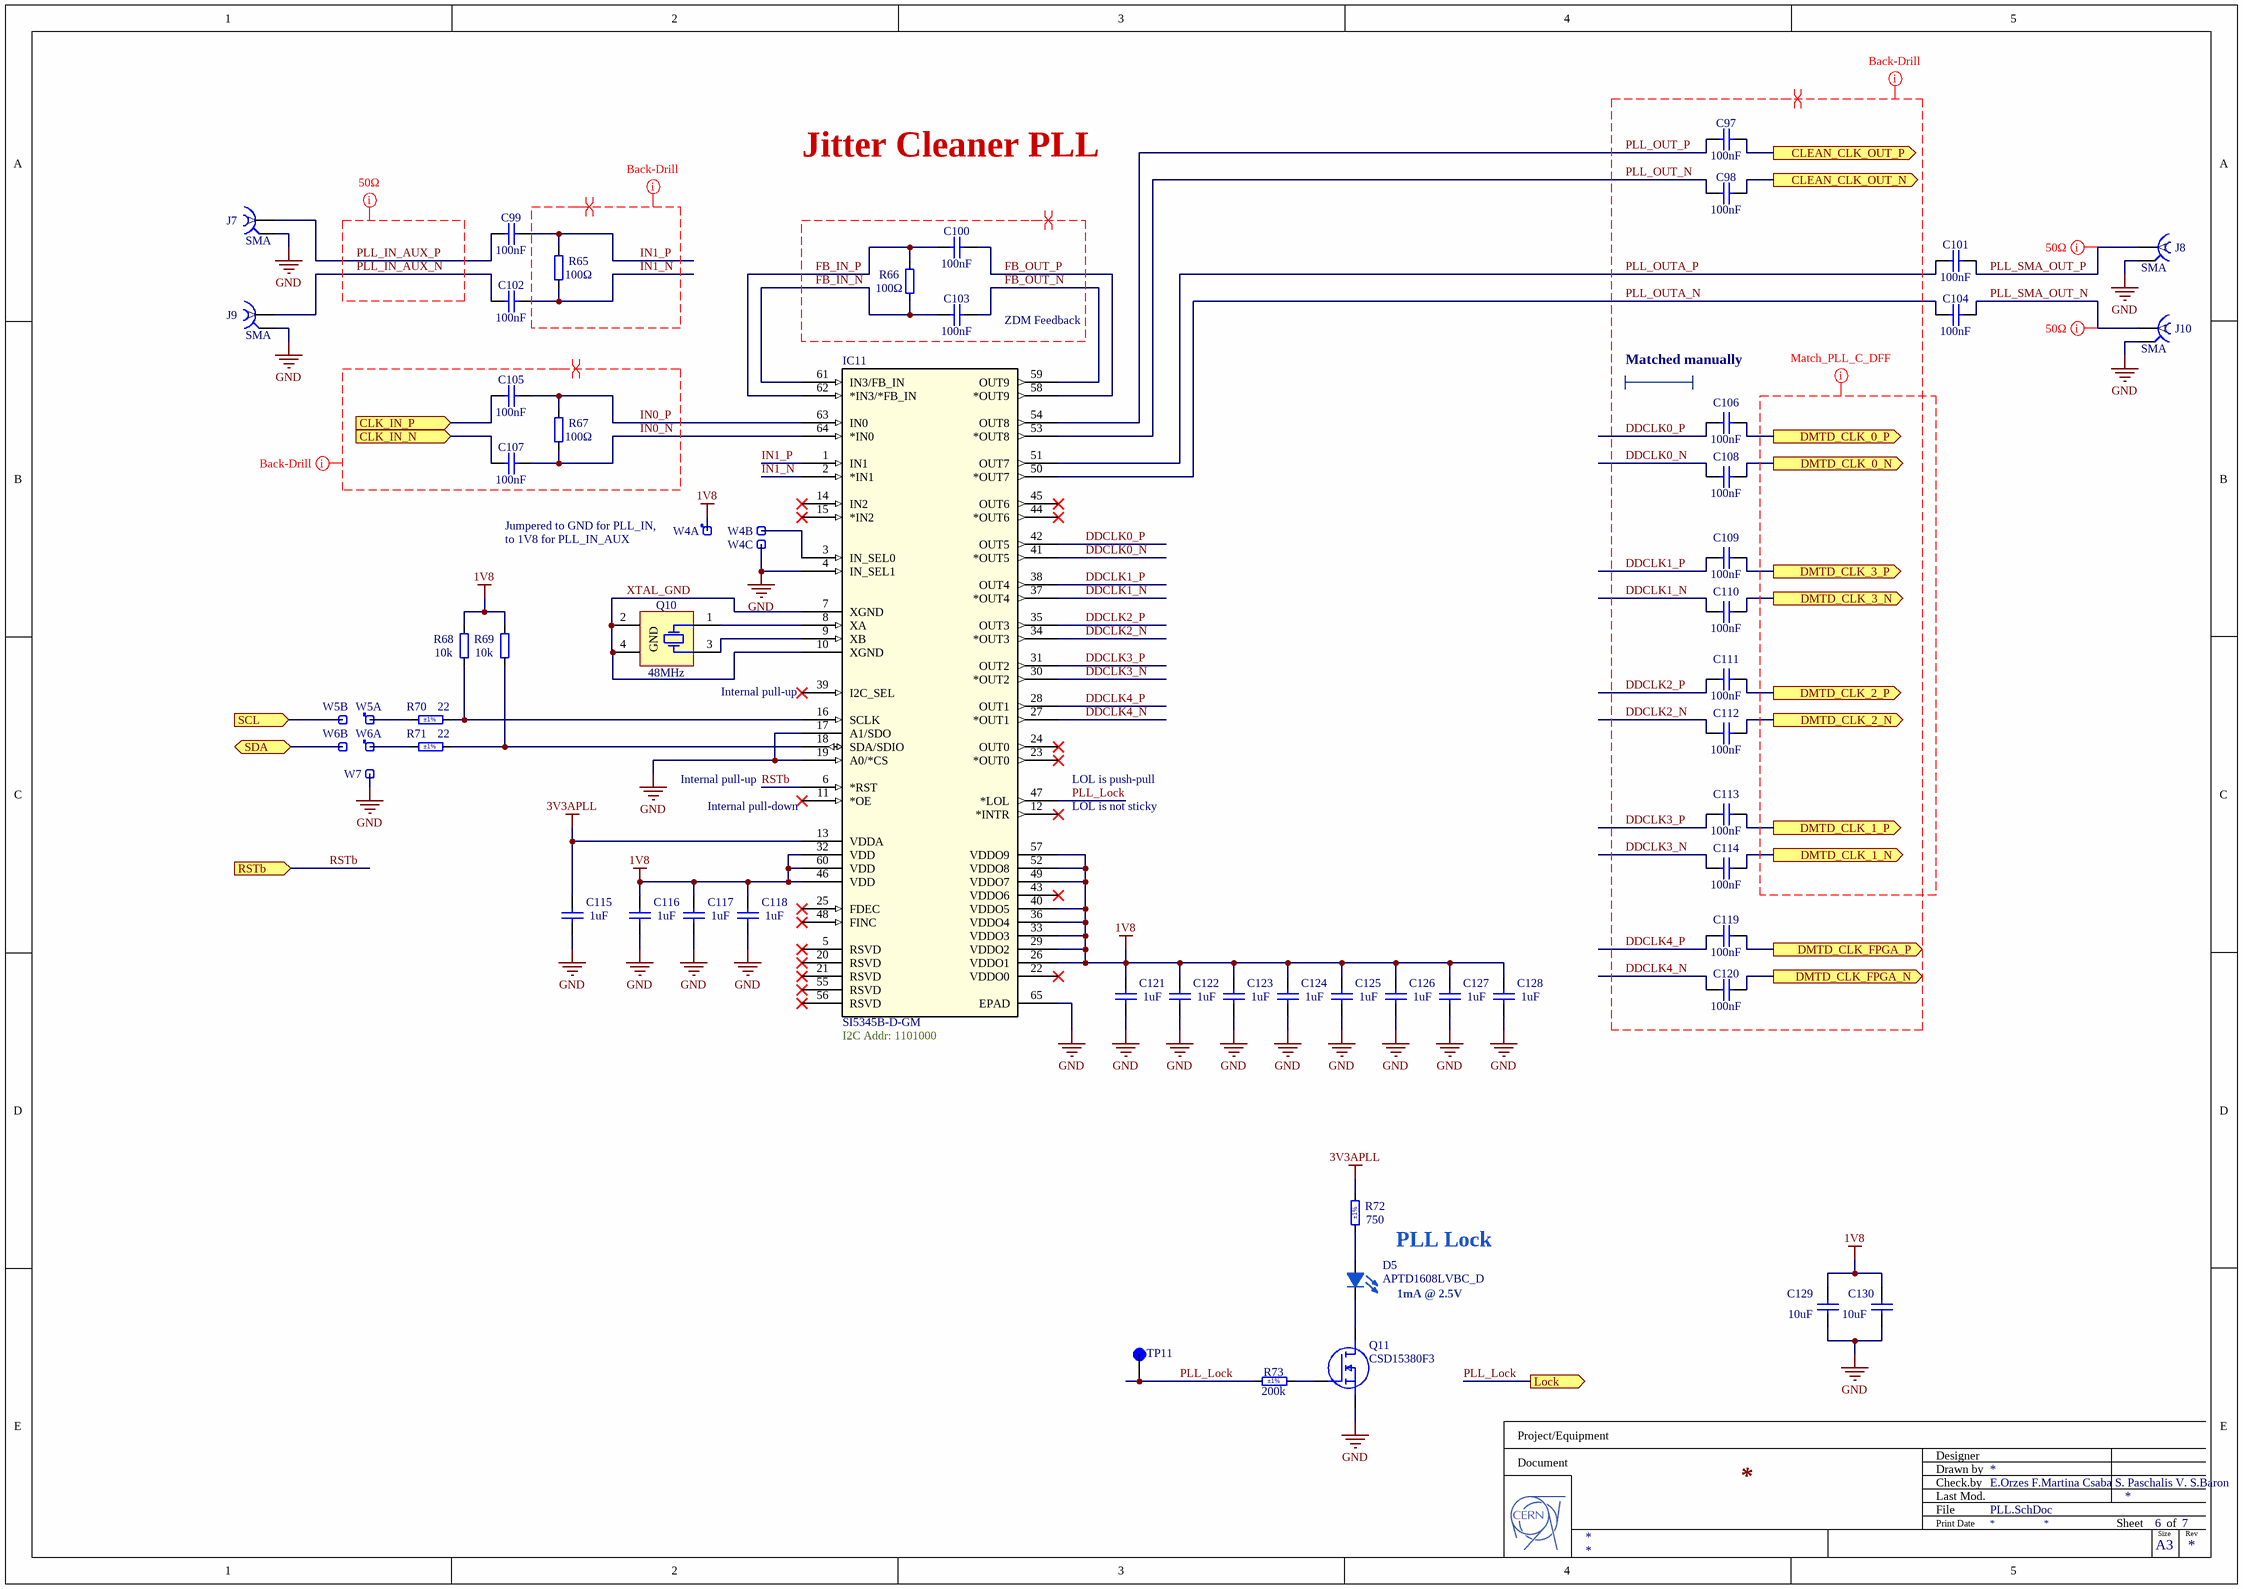
[diagram p5: PLL.SchDoc]

### Parts
C97  100nF  [MURATA_HI_DENSITY_0201]
C98  100nF  [MURATA_HI_DENSITY_0201]
C99  100nF  [MURATA_HI_DENSITY_0201]
C100  100nF  [MURATA_HI_DENSITY_0201]
C101  100nF  [MURATA_HI_DENSITY_0201]
C102  100nF  [MURATA_HI_DENSITY_0201]
C103  100nF  [MURATA_HI_DENSITY_0201]
C104  100nF  [MURATA_HI_DENSITY_0201]
C105  100nF  [MURATA_HI_DENSITY_0201]
C106  100nF  [MURATA_HI_DENSITY_0201]
C107  100nF  [MURATA_HI_DENSITY_0201]
C108  100nF  [MURATA_HI_DENSITY_0201]
C109  100nF  [MURATA_HI_DENSITY_0201]
C110  100nF  [MURATA_HI_DENSITY_0201]
C111  100nF  [MURATA_HI_DENSITY_0201]
C112  100nF  [MURATA_HI_DENSITY_0201]
C113  100nF  [MURATA_HI_DENSITY_0201]
C114  100nF  [MURATA_HI_DENSITY_0201]
C115  1uF  [CAPC1005X55N]
C116  1uF  [CAPC1005X55N]
C117  1uF  [CAPC1005X55N]
C118  1uF  [CAPC1005X55N]
C119  100nF  [MURATA_HI_DENSITY_0201]
C120  100nF  [MURATA_HI_DENSITY_0201]
C121  1uF  [CAPC1005X55N]
C122  1uF  [CAPC1005X55N]
C123  1uF  [CAPC1005X55N]
C124  1uF  [CAPC1005X55N]
C125  1uF  [CAPC1005X55N]
C126  1uF  [CAPC1005X55N]
C127  1uF  [CAPC1005X55N]
C128  1uF  [CAPC1005X55N]
C129  10uF  [CAPC1608X87N]
C130  10uF  [CAPC1608X87N]
D5  APTD1608LVBC_D  [LEDC1608X110N]
IC11  SI5345B-D-GM  [QFN50P900X900X90-65N-D]
J7  SMA  [SAMTEC_SMA-J-P-H-ST-MT1]
J8  SMA  [SAMTEC_SMA-J-P-H-ST-MT1]
J9  SMA  [SAMTEC_SMA-J-P-H-ST-MT1]
J10  SMA  [SAMTEC_SMA-J-P-H-ST-MT1]
Q10  48MHz  [XTAL_KYOCERA_CX3225SB]
Q11  CSD15380F3  [CSD15380F3]
R65  100Ω  [MURATA_HI_DENSITY_0201]
R66  100Ω  [MURATA_HI_DENSITY_0201]
R67  100Ω  [MURATA_HI_DENSITY_0201]
R68  10k  [MURATA_HI_DENSITY_0201]
R69  10k  [MURATA_HI_DENSITY_0201]
R70  22  Tolerance: ±1%  [RESC1005X40N]
R71  22  Tolerance: ±1%  [RESC1005X40N]
R72  750  Tolerance: ±1%  [RESC1005X40N]
R73  200k  Tolerance: ±1%  [RESC1005X40N]
TP11  RCU-0C  [TP+195X110]  (value not drawn)
W4  Header 3  [SAMTEC_HTSW-103-23-L-S]  (value not drawn)  (parts A,B,C of 3)
W5  Header 2  [SAMTEC_HTSW-102-23-L-S]  (value not drawn)  (parts A,B of 2)
W6  Header 2  [SAMTEC_HTSW-102-23-L-S]  (value not drawn)  (parts A,B of 2)
W7  Header 1  [SAMTEC_HTSW-101-23-L-S]  (value not drawn)

### Ports
CLEAN_CLK_OUT_N (out), CLEAN_CLK_OUT_P (out), CLK_IN_N (in), CLK_IN_P (in), DMTD_CLK_0_N (out), DMTD_CLK_0_P (out), DMTD_CLK_1_N (out), DMTD_CLK_1_P (out), DMTD_CLK_2_N (out), DMTD_CLK_2_P (out), DMTD_CLK_3_N (out), DMTD_CLK_3_P (out), DMTD_CLK_FPGA_N (out), DMTD_CLK_FPGA_P (out), Lock (out), RSTb (in), SCL (in), SDA (bidir)

### Nets
1V8: C116.2 C117.2 C118.2 C121.2 C122.2 C123.2 C124.2 C125.2 C126.2 C127.2 C128.2 C129.2 C130.2 IC11.26(VDDO1) IC11.29(VDDO2) IC11.32(VDD) IC11.33(VDDO3) IC11.36(VDDO4) IC11.40(VDDO5) IC11.46(VDD) IC11.49(VDDO7) IC11.52(VDDO8) IC11.57(VDDO9) IC11.60(VDD) R68.2 R69.2 W4.1
3V3APLL: C115.2 IC11.13(VDDA) R72.2
GND: C115.1 C116.1 C117.1 C118.1 C121.1 C122.1 C123.1 C124.1 C125.1 C126.1 C127.1 C128.1 C129.1 C130.1 IC11.4(IN_SEL1) IC11.17(A1/SDO) IC11.19(A0/*CS) IC11.65(EPAD) J7.2 J8.2 J9.2 J10.2 Q11.2(S) W4.3 W7.1
CLN_RXUSRCLK_N: C98.2 ; port CLEAN_CLK_OUT_N
CLN_RXUSRCLK_P: C97.2 ; port CLEAN_CLK_OUT_P
DDCLK0_N: C108.1 IC11.41(*OUT5)
DDCLK0_P: C106.1 IC11.42(OUT5)
DDCLK1_N: C110.1 IC11.37(*OUT4)
DDCLK1_P: C109.1 IC11.38(OUT4)
DDCLK2_N: C112.1 IC11.34(*OUT3)
DDCLK2_P: C111.1 IC11.35(OUT3)
DDCLK3_N: C114.1 IC11.30(*OUT2)
DDCLK3_P: C113.1 IC11.31(OUT2)
DDCLK4_N: C120.1 IC11.27(*OUT1)
DDCLK4_P: C119.1 IC11.28(OUT1)
DMTD_CLK_0_N: C108.2 ; port DMTD_CLK_0_N
DMTD_CLK_0_P: C106.2 ; port DMTD_CLK_0_P
DMTD_CLK_1_N: C114.2 ; port DMTD_CLK_1_N
DMTD_CLK_1_P: C113.2 ; port DMTD_CLK_1_P
DMTD_CLK_2_N: C112.2 ; port DMTD_CLK_2_N
DMTD_CLK_2_P: C111.2 ; port DMTD_CLK_2_P
DMTD_CLK_3_N: C110.2 ; port DMTD_CLK_3_N
DMTD_CLK_3_P: C109.2 ; port DMTD_CLK_3_P
DMTD_CLK_FPGA_N: C120.2 ; port DMTD_CLK_FPGA_N
DMTD_CLK_FPGA_P: C119.2 ; port DMTD_CLK_FPGA_P
FB_IN_N: C103.1 IC11.61(IN3/FB_IN) R66.1
FB_IN_P: C100.1 IC11.62(*IN3/*FB_IN) R66.2
FB_OUT_N: C103.2 IC11.59(OUT9)
FB_OUT_P: C100.2 IC11.58(*OUT9)
IN0_N: C107.1 IC11.64(*IN0) R67.1
IN0_P: C105.1 IC11.63(IN0) R67.2
IN1_N: C102.1 IC11.2(*IN1) R65.1
IN1_P: C99.1 IC11.1(IN1) R65.2
PLL_IN_AUX_N: C102.2 J9.1
PLL_IN_AUX_P: C99.2 J7.1
PLL_Lock: IC11.47(*LOL) R73.1 TP11.1(TP) ; port Lock
PLL_OUT_N: C98.1 IC11.53(*OUT8)
PLL_OUT_P: C97.1 IC11.54(OUT8)
PLL_OUTA_N: C104.1 IC11.50(*OUT7)
PLL_OUTA_P: C101.1 IC11.51(OUT7)
PLL_SMA_OUT_N: C104.2 J10.1
PLL_SMA_OUT_P: C101.2 J8.1
RSTb: IC11.6(*RST) ; port RSTb  [project net PLL_RSTb]
RXUSRCLK_N: C107.2 ; port CLK_IN_N
RXUSRCLK_P: C105.2 ; port CLK_IN_P
SCL_PLL: W5.2 ; port SCL
SDA_PLL: W6.2 ; port SDA
XTAL_GND: IC11.7(XGND) IC11.10(XGND) Q10.2(GND) Q10.4(GND)
NetD5_1: D5.1(K) Q11.3(D)
NetD5_2: D5.2(A) R72.1
NetIC11_3: IC11.3(IN_SEL0) W4.2
NetIC11_8: IC11.8(XA) Q10.1(X)
NetIC11_9: IC11.9(XB) Q10.3(X)
NetIC11_16: IC11.16(SCLK) R68.1 R70.2
NetIC11_18: IC11.18(SDA/SDIO) R69.1 R71.2
NetQ11_1: Q11.1(G) R73.2
NetR70_1: R70.1 W5.1
NetR71_1: R71.1 W6.1

Not connected (* = marked no-connect by the designer): IC11 5(RSVD)* 11(*OE)* 12(*INTR)* 14(IN2)* 15(*IN2)* 20(RSVD)* 21(RSVD)* 22(VDDO0)* 23(*OUT0)* 24(OUT0)* 25(FDEC)* 39(I2C_SEL)* 43(VDDO6)* 44(*OUT6)* 45(OUT6)* 48(FINC)* 55(RSVD)* 56(RSVD)*

### Layout directives
differential pair: DDCLK0_N, DDCLK0_P, DDCLK1_N, DDCLK1_P, DDCLK2_N, DDCLK2_P, DDCLK3_N, DDCLK3_P, DDCLK4_N, DDCLK4_P, FB_IN_N, FB_IN_P, FB_OUT_N, FB_OUT_P, IN0_N, IN0_P, IN1_N, IN1_P, PLL_OUT_N, PLL_OUT_P, PLL_OUTA_N, PLL_OUTA_P
net class 50ohm: PLL_IN_AUX_N, PLL_IN_AUX_P, PLL_SMA_OUT_N, PLL_SMA_OUT_P
net class Back-Drill: DDCLK0_N, DDCLK0_P, DDCLK1_N, DDCLK1_P, DDCLK2_N, DDCLK2_P, DDCLK3_N, DDCLK3_P, DDCLK4_N, DDCLK4_P, IN0_N, IN0_P, IN1_N, IN1_P, PLL_OUT_N, PLL_OUT_P, PLL_OUTA_N, PLL_OUTA_P
net class Match_PLL_C_DFF: DDCLK0_N, DDCLK0_P, DDCLK1_N, DDCLK1_P, DDCLK2_N, DDCLK2_P, DDCLK3_N, DDCLK3_P, DDCLK4_N, DDCLK4_P, PLL_OUT_N, PLL_OUT_P, PLL_OUTA_N, PLL_OUTA_P

### Notes on the sheet
- Jitter Cleaner PLL
- ZDM Feedback
- Matched manually
- Jumpered to GND for PLL_IN, to 1V8 for PLL_IN_AUX
- (near IC11) Internal pull-up
- Internal pull-up
- LOL is push-pull
- (near IC11) Internal pull-down
- LOL is not sticky
- (near IC11) I2C Addr: 1101000
- PLL Lock
- 1mA @ 2.5V
- Project/Equipment
- Document
- Designer
- Drawn by
- Check.by
- File
- Last Mod.
- Print Date
- Sheet
- Size
- A3
- of
- Rev

### Library data of the parts
C97-C114 C119 C120 = C0201-100nF-high-density: GRM033R61C104KE14; Vmax: 16V; Value: 100nF
C115-C118 C121-C128 = CC0402_1UF_16V_10%_X5R: GRM153B30J105ME15; Part Description: SMD Multilayer Chip Ceramic Capacitor; Manufacturer: GENERIC; Manufacturer1 Part Number: C1005X5R1C105KT; Voltage: 16V; TC: X5R; Tolerance: ±10%; Part Number: CC0402_1UF_16V_10%_X5R; Component Kind: Standard; Component Type: Standard; Pin Count: 2; Value: 1uF; Status: Preferred; Manufacturer Part Number: CC0402_1UF_16V_10%_X5R; Case: 0402; Mounted: Yes; Socket: No; SMD: Yes; Sense: No; Manufacturer1 Example: TDK; Manufacturer1 ComponentHeight: 0.55mm; HelpURL: \\cern.ch\dfs\Applications\Altium\Datasheets\CC0402_X5R_TDK_C.pdf; Author: CERN DEM JLC; CreateDate: 10/25/2012; LatestRevisionDate: 10/25/2012
C129 C130 = CC0603_10UF_6.3V_20%_X5R: C1608X5R1E106M080AC; Part Description: SMD Multilayer Chip Ceramic Capacitor; Manufacturer: GENERIC; Manufacturer1 Part Number: C0603C106M9PAC; Voltage: 6.3V; TC: X5R; Tolerance: ±20%; Part Number: CC0603_10UF_6.3V_20%_X5R; Component Kind: Standard; Component Type: Standard; Pin Count: 2; Value: 10uF; Status: Preferred; Manufacturer Part Number: CC0603_10uF_6.3V_20%_X5R; Case: 0603; Mounted: Yes; Socket: No; SMD: Yes; Sense: No; Manufacturer1 Example: KEMET; Manufacturer1 ComponentHeight: 0.95mm; HelpURL: \\cern.ch\dfs\Applications\Altium\Datasheets\CC0603_X5R_KEMET.pdf; Author: CERN DEM JLC; CreateDate: 03/12/2007; LatestRevisionDate: 03/12/2007
D5 = APTD1608LVBC_D: LED; Manufacturer_Name: Kingbright; Manufacturer_Part_Number: APTD1608LVBC/D; Datasheet Link: https://componentsearchengine.com/Datasheets/1/APTD1608LVBC_D.pdf; Height: 1.1mm; Mouser Part Number: 604-APTD1608LVBCD; Mouser Price/Stock: https://www.mouser.co.uk/ProductDetail/Kingbright/APTD1608LVBC-D?qs=6oMev5NRZMEfNSg5xIhlKA%3D%3D; Arrow Part Number: APTD1608LVBC/D; Arrow Price/Stock: https://www.arrow.com/en/products/aptd1608lvbcd/kingbright?utm_currency=USD&region=nac
IC11 = SI5345B-D-GM: Integrated Circuit; Manufacturer_Name: Skyworks; Datasheet Link: https://www.mouser.sg/datasheet/2/472/si5345_44_42_d_datasheet-2507675.pdf; Height: 0.9mm; Manufacturer_Part_Number: SI5345B-D-GM; Mouser Part Number: 634-SI5345B-D-GM; Mouser Price/Stock: https://www.mouser.co.uk/ProductDetail/Skyworks-Solutions-Inc/SI5345B-D-GM?qs=p9T7GgSe1IGHqFUKlxUKrA%3D%3D
J7-J10 = SAMTEC_SMA-J-P-H-ST-MT1: Part Description: 50 Ohms SMA Straight Mixed Technology PCB Jack; Manufacturer: SAMTEC; PressFit: No; Sense Comment: assembly limitations; Part Number: SAMTEC_SMA-J-P-H-ST-MT1; Component Kind: Standard; Component Type: Standard; Pin Count: 5; Family: SMA; Mounted: Yes; Socket: No; SMD: Yes; Sense: Yes; Status: Not Recommended; Manufacturer Part Number: SMA-J-P-H-ST-MT1; ComponentHeight: 7.95mm; HelpURL: \\cern.ch\dfs\Applications\Altium\Datasheets\SAMTEC_SMA-J-P-H-ST-MT1.pdf; Author: CERN DEM HF; CreateDate: 5/24/2023; LatestRevisionDate: 5/24/2023
Q10 = XTAL_48MHZ_KYOCERA_CX3225SB48000D0FPJC1: Crystal 4 pins 1=XTAL Control 2=GND3=XTAL 4=GND; Part Description: Tolerance: ±10ppm, Stability: ±15ppm, 8pF, -40°C to +85°C, Surface Mount Crystal; PressFit: No; Bonding: No; Part Number: XTAL_48MHZ_KYOCERA_CX3225SB48000D0FPJC1; Component Kind: Standard; Component Type: Standard; PackageDescription: SMD Crystal Kyocera, 4 Pins, 2.50mm L X 3.20mm W X 0.6mm H; Value: 48MHz; Manufacturer: KYOCERA; Manufacturer Part Number: CX3225SB48000D0FPJC1; Pin Count: 4; Mounted: Yes; Socket: No; SMD: Yes; Sense: No; ComponentHeight: 0.6mm; HelpURL: \\cern.ch\dfs\Applications\Altium\Datasheets\XTAL_KYOCERA_CX3225SB.pdf; Author: CERN DEM JLC; CreateDate: 6/5/2018; LatestRevisionDate: 6/5/2018
Q11 = CSD15380F3: MOSFET (N-Channel); Manufacturer_Name: Texas Instruments; Datasheet Link: https://www.ti.com/lit/ds/symlink/csd15380f3.pdf?ts=1641221366106&ref_url=https%253A%252F%252Fwww.google.com%252F; Height: 0.35mm; Manufacturer_Part_Number: CSD15380F3; Mouser Part Number: 595-CSD15380F3; Mouser Price/Stock: https://www.mouser.co.uk/ProductDetail/Texas-Instruments/CSD15380F3?qs=zEmsApcVOkXP46xhm0edmA%3D%3D; Arrow Part Number: CSD15380F3; Arrow Price/Stock: https://www.arrow.com/en/products/csd15380f3/texas-instruments?region=nac
R65-R67 = R0201-100ohm-high-density: Resistor; Value: 100Ω
R68 R69 = R0201-100ohm-high-density: Resistor 10k; Value: 100Ω
R70 R71 = R0402_22R_1%_0.0625W_100PPM: Resistor - 1%; Part Description: General Purpose Thick Film Chip Resistor; Manufacturer: GENERIC; Manufacturer1 Part Number: 232270672209L; TC: ±100ppm/°C; PressFit: No; Part Number: R0402_22R_1%_0.0625W_100PPM; Component Kind: Standard; Component Type: Standard; Pin Count: 2; Value: 22; Status: Not Recommended; Power: 0.0625W; Manufacturer Part Number: R0402_22R_1%_0.0625W_100PPM; Case: 0402; Mounted: Yes; Sense: No; Socket: No; SMD: Yes; Manufacturer1 Example: YAGEO PHYCOMP; Manufacturer1 ComponentHeight: 0.4mm; HelpURL: \\cern.ch\dfs\Applications\Altium\Datasheets\R0402_Phycomp_RC0402.pdf; Author: CERN DEM JLC; CreateDate: 12/3/2007; LatestRevisionDate: 10/17/2012
R72 = R0402_750R_1%_0.0625W_100PPM: Resistor - 1%; Part Description: General Purpose Thick Film Chip Resistor; Manufacturer: GENERIC; Manufacturer1 Part Number: 232270677501L; TC: ±100ppm/°C; PressFit: No; Part Number: R0402_750R_1%_0.0625W_100PPM; Component Kind: Standard; Component Type: Standard; Pin Count: 2; Value: 750; Status: Not Recommended; Power: 0.0625W; Manufacturer Part Number: R0402_750R_1%_0.0625W_100PPM; Case: 0402; Mounted: Yes; Sense: No; Socket: No; SMD: Yes; Manufacturer1 Example: YAGEO PHYCOMP; Manufacturer1 ComponentHeight: 0.4mm; HelpURL: \\cern.ch\dfs\Applications\Altium\Datasheets\R0402_Phycomp_RC0402.pdf; Author: CERN DEM JLC; CreateDate: 12/3/2007; LatestRevisionDate: 10/17/2012
R73 = R0402_200K_1%_0.0625W_100PPM: Resistor - 1%; Part Description: General Purpose Thick Film Chip Resistor; Manufacturer: GENERIC; Manufacturer1 Part Number: 232270672004L; TC: ±100ppm/°C; PressFit: No; Part Number: R0402_200K_1%_0.0625W_100PPM; Component Kind: Standard; Component Type: Standard; Pin Count: 2; Value: 200k; Status: Not Recommended; Power: 0.0625W; Manufacturer Part Number: R0402_200K_1%_0.0625W_100PPM; Case: 0402; Mounted: Yes; Sense: No; Socket: No; SMD: Yes; Manufacturer1 Example: YAGEO PHYCOMP; Manufacturer1 ComponentHeight: 0.4mm; HelpURL: \\cern.ch\dfs\Applications\Altium\Datasheets\R0402_Phycomp_RC0402.pdf; Author: CERN DEM JLC; CreateDate: 12/3/2007; LatestRevisionDate: 10/17/2012
TP11 = RCU-0C: MF: {'manufacturer': u'TE Connectivity AMP Connectors'}; Package: None; Price: None; Value: *; MP: RCU-0C; Availability: Unavailable
W4 = SAMTEC_HTSW-103-23-L-S: 3 Mini Wire-Wrap Contact Strip Header; Part Description: 3 Contacts, Pitch 2.54mm, Single Row Through Mount Straight Header (Post Lead 5.84mm, Tail Lead 2.92mm, Insulator 2.54mm); Manufacturer: SAMTEC; PressFit: No; Status Comment: High Temperature; Part Number: SAMTEC_HTSW-103-23-L-S; Component Kind: Standard; Component Type: Standard; Pin Count: 3; Family: Header 3; Mounted: Yes; Socket: No; SMD: No; Sense: No; Status: Preferred; Manufacturer Part Number: HTSW-103-23-L-S; ComponentHeight: 8.38mm; HelpURL: \\cern.ch\dfs\Applications\Altium\Datasheets\SAMTEC_HTSW-103-23-L-S.pdf; Author: CERN DEM JLC; CreateDate: 2/22/2018; LatestRevisionDate: 2/22/2018
W5 W6 = SAMTEC_HTSW-102-23-L-S: 2 Mini Wire-Wrap Contact Strip Header; Part Description: 2 Contacts, Pitch 2.54mm, Single Row  Through Mount Straight Header (Post Lead 5.84mm, Tail Lead 2.92mm, Insulator 2.54mm); Manufacturer: SAMTEC; PressFit: No; Status Comment: High Temperature; Part Number: SAMTEC_HTSW-102-23-L-S; Component Kind: Standard; Component Type: Standard; Pin Count: 2; Family: Header 2; Mounted: Yes; Socket: No; SMD: No; Sense: No; Status: Preferred; Manufacturer Part Number: HTSW-102-23-L-S; ComponentHeight: 8.38mm; HelpURL: \\cern.ch\dfs\Applications\Altium\Datasheets\SAMTEC_HTSW-102-23-L-S.pdf; Author: CERN DEM JLC; CreateDate: 2/22/2018; LatestRevisionDate: 2/22/2018
W7 = SAMTEC_HTSW-101-23-L-S: Single Mini Wire-Wrap Contact; Part Description: Single Contact Through Mount Straight Header (Post Lead 5.84mm, Tail Lead 2.92mm, Insulator 2.54mm); Manufacturer: SAMTEC; PressFit: No; Status Comment: High Temperature; Part Number: SAMTEC_HTSW-101-23-L-S; Component Kind: Standard; Component Type: Standard; Pin Count: 1; Family: Header 1; Mounted: Yes; Socket: No; SMD: No; Sense: No; Status: Preferred; Manufacturer Part Number: HTSW-101-23-L-S; ComponentHeight: 8.38mm; HelpURL: \\cern.ch\dfs\Applications\Altium\Datasheets\SAMTEC_HTSW-101-23-L-S.pdf; Author: CERN DEM JLC; CreateDate: 2/22/2018; LatestRevisionDate: 2/22/2018

## Sheet FMC.SchDoc
size 420 x 297 mm; SheetNumber: 5; SheetTotal: 7
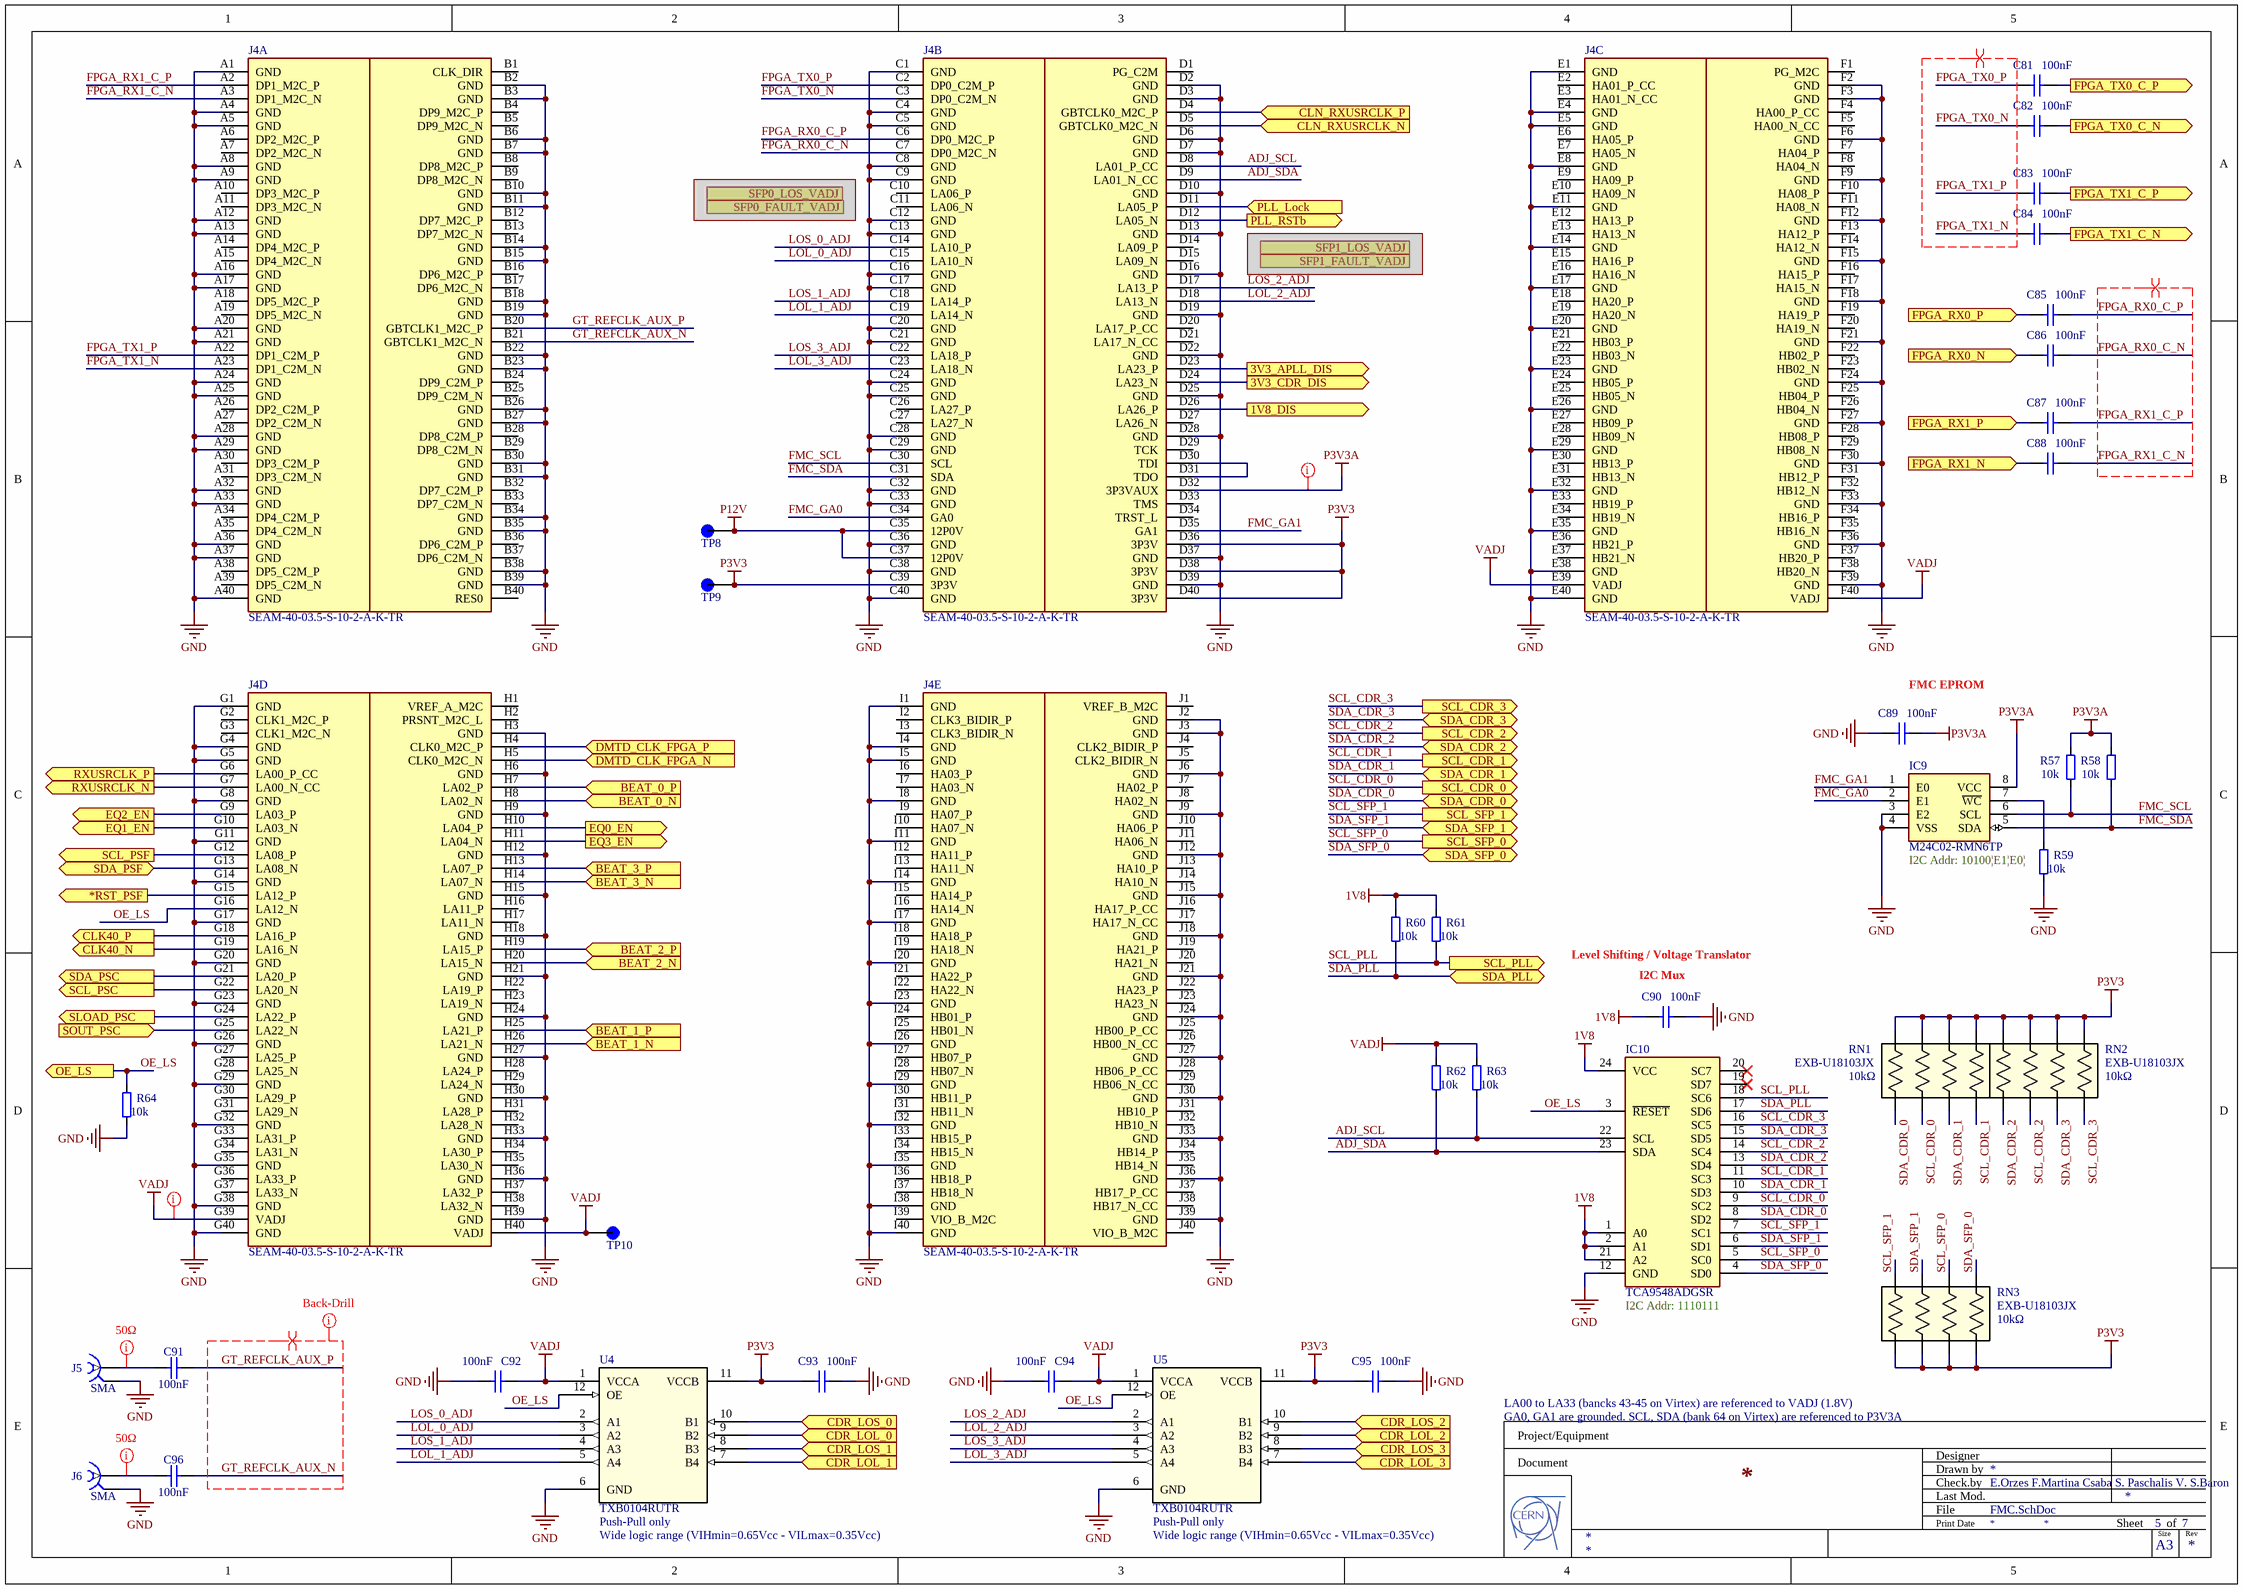
[diagram p6: FMC.SchDoc]

### Parts
(Parts that share a designator on the sheet are numbered #1, #2 ... from top to bottom, then left to right.)
C81  100nF  [MURATA_HI_DENSITY_0201]
C82  100nF  [MURATA_HI_DENSITY_0201]
C83  100nF  [MURATA_HI_DENSITY_0201]
C84  100nF  [MURATA_HI_DENSITY_0201]
C85  100nF  [MURATA_HI_DENSITY_0201]
C86  100nF  [MURATA_HI_DENSITY_0201]
C87  100nF  [MURATA_HI_DENSITY_0201]
C88  100nF  [MURATA_HI_DENSITY_0201]
C89  100nF  [MURATA_HI_DENSITY_0201]
C90  100nF  [MURATA_HI_DENSITY_0201]
C91  100nF  [MURATA_HI_DENSITY_0201]
C92  100nF  [MURATA_HI_DENSITY_0201]
C93  100nF  [MURATA_HI_DENSITY_0201]
C94  100nF  [MURATA_HI_DENSITY_0201]
C95  100nF  [MURATA_HI_DENSITY_0201]
C96  100nF  [MURATA_HI_DENSITY_0201]
IC9  M24C02-RMN6TP  [SOIC127P600X175-8N]
IC10  TCA9548ADGSR  [SOP50P490X110-24N]
J4  SEAM-40-03.5-S-10-2-A-K-TR  [SAMTEC_SEAM-40-03.5-S-10-2-A-K-TR]  (parts A,B,C,D,E of 5)
J5  SMA  [SAMTEC_SMA-J-P-H-ST-MT1]
J6  SMA  [SAMTEC_SMA-J-P-H-ST-MT1]
R57  10k  [MURATA_HI_DENSITY_0201]
R58  10k  [MURATA_HI_DENSITY_0201]
R59  10k  [MURATA_HI_DENSITY_0201]
R60  10k  [MURATA_HI_DENSITY_0201]
R61  10k  [MURATA_HI_DENSITY_0201]
R62  10k  [MURATA_HI_DENSITY_0201]
R63  10k  [MURATA_HI_DENSITY_0201]
R64  10k  [MURATA_HI_DENSITY_0201]
RN1  EXB-U18103JX  [EXBU18]
RN2  EXB-U18103JX  [EXBU18]
RN3#2  EXB-U18103JX  [EXBU18]
TP8  RCU-0C  [TP+195X110]  (value not drawn)
TP9  RCU-0C  [TP+195X110]  (value not drawn)
TP10  RCU-0C  [TP+195X110]  (value not drawn)
U4  TXB0104RUTR  [RUT12_TEX]
U5  TXB0104RUTR  [RUT12_TEX]

### Ports
1V8_DIS (out), 3V3_APLL_DIS (out), 3V3_CDR_DIS (out), *RST_PSF (out), BEAT_0_N (in), BEAT_0_P (in), BEAT_1_N (in), BEAT_1_P (in), BEAT_2_N (in), BEAT_2_P (in), BEAT_3_N (in), BEAT_3_P (in), CDR_LOL_0 (in), CDR_LOL_1 (in), CDR_LOL_2 (in), CDR_LOL_3 (in), CDR_LOS_0 (in), CDR_LOS_1 (in), CDR_LOS_2 (in), CDR_LOS_3 (in), CLK40_N (out), CLK40_P (out), CLN_RXUSRCLK_N (in), CLN_RXUSRCLK_P (in), DMTD_CLK_FPGA_N (in), DMTD_CLK_FPGA_P (in), EQ0_EN (out), EQ1_EN (out), EQ2_EN (out), EQ3_EN (out), FPGA_RX0_N (in), FPGA_RX0_P (in), FPGA_RX1_N (in), FPGA_RX1_P (in), FPGA_TX0_C_N (out), FPGA_TX0_C_P (out), FPGA_TX1_C_N (out), FPGA_TX1_C_P (out), OE_LS (out), PLL_Lock (in), PLL_RSTb (out), RXUSRCLK_N (out), RXUSRCLK_P (out), SCL_CDR_0 (out), SCL_CDR_1 (out), SCL_CDR_2 (out), SCL_CDR_3 (out), SCL_PLL (out), SCL_PSC (out), SCL_PSF (out), SCL_SFP_0 (out), SCL_SFP_1 (out), SDA_CDR_0 (bidir), SDA_CDR_1 (bidir), SDA_CDR_2 (bidir), SDA_CDR_3 (bidir), SDA_PLL (bidir), SDA_PSC (out), SDA_PSF (bidir), SDA_SFP_0 (bidir), SDA_SFP_1 (bidir), SFP0_FAULT_VADJ (in), SFP0_LOS_VADJ (in), SFP1_FAULT_VADJ (in), SFP1_LOS_VADJ (in), SLOAD_PSC (out), SOUT_PSC (in)

### Nets
1V8: C90.2 IC10.1(A0) IC10.2(A1) IC10.21(A2) IC10.24(VCC) R60.2 R61.2
GND: C89.1 C90.1 C92.1 C93.1 C94.1 C95.1 IC9.3(E2) IC9.4(VSS) IC10.12(GND) J4.A1(GND) J4.A4(GND) J4.A5(GND) J4.A8(GND) J4.A9(GND) J4.A12(GND) J4.A13(GND) J4.A16(GND) J4.A17(GND) J4.A20(GND) J4.A21(GND) J4.A24(GND) J4.A25(GND) J4.A28(GND) J4.A29(GND) J4.A32(GND) J4.A33(GND) J4.A36(GND) J4.A37(GND) J4.A40(GND) J4.B2(GND) J4.B3(GND) J4.B6(GND) J4.B7(GND) J4.B10(GND) J4.B11(GND) J4.B14(GND) J4.B15(GND) J4.B18(GND) J4.B19(GND) J4.B22(GND) J4.B23(GND) J4.B26(GND) J4.B27(GND) J4.B30(GND) J4.B31(GND) J4.B34(GND) J4.B35(GND) J4.B38(GND) J4.B39(GND) J4.C1(GND) J4.C4(GND) J4.C5(GND) J4.C8(GND) J4.C9(GND) J4.C12(GND) J4.C13(GND) J4.C16(GND) J4.C17(GND) J4.C20(GND) J4.C21(GND) J4.C24(GND) J4.C25(GND) J4.C28(GND) J4.C29(GND) J4.C32(GND) J4.C33(GND) J4.C36(GND) J4.C38(GND) J4.C40(GND) J4.D2(GND) J4.D3(GND) J4.D6(GND) J4.D7(GND) J4.D10(GND) J4.D13(GND) J4.D16(GND) J4.D19(GND) J4.D22(GND) J4.D25(GND) J4.D28(GND) J4.D37(GND) J4.D39(GND) J4.E1(GND) J4.E4(GND) J4.E5(GND) J4.E8(GND) J4.E11(GND) J4.E14(GND) J4.E17(GND) J4.E20(GND) J4.E23(GND) J4.E26(GND) J4.E29(GND) J4.E32(GND) J4.E35(GND) J4.E38(GND) J4.E40(GND) J4.F2(GND) J4.F3(GND) J4.F6(GND) J4.F9(GND) J4.F12(GND) J4.F15(GND) J4.F18(GND) J4.F21(GND) J4.F24(GND) J4.F27(GND) J4.F30(GND) J4.F33(GND) J4.F36(GND) J4.F39(GND) J4.G1(GND) J4.G4(GND) J4.G5(GND) J4.G8(GND) J4.G11(GND) J4.G14(GND) J4.G17(GND) J4.G20(GND) J4.G23(GND) J4.G26(GND) J4.G29(GND) J4.G32(GND) J4.G35(GND) J4.G38(GND) J4.G40(GND) J4.H3(GND) J4.H6(GND) J4.H9(GND) J4.H12(GND) J4.H15(GND) J4.H18(GND) J4.H21(GND) J4.H24(GND) J4.H27(GND) J4.H30(GND) J4.H33(GND) J4.H36(GND) J4.H39(GND) J4.I1(GND) J4.I4(GND) J4.I5(GND) J4.I8(GND) J4.I11(GND) J4.I14(GND) J4.I17(GND) J4.I20(GND) J4.I23(GND) J4.I26(GND) J4.I29(GND) J4.I32(GND) J4.I35(GND) J4.I38(GND) J4.I40(GND) J4.J2(GND) J4.J3(GND) J4.J6(GND) J4.J9(GND) J4.J12(GND) J4.J15(GND) J4.J18(GND) J4.J21(GND) J4.J24(GND) J4.J27(GND) J4.J30(GND) J4.J33(GND) J4.J36(GND) J4.J39(GND) J5.2 J6.2 R59.1 R64.1 U4.6(GND) U5.6(GND)
P3V3: C93.2 C95.2 J4.C39(3P3V) J4.D36(3P3V) J4.D38(3P3V) J4.D40(3P3V) RN1.5 RN1.6 RN1.7 RN1.8 RN2.5 RN2.6 RN2.7 RN2.8 RN3#2.1 RN3#2.2 RN3#2.3 RN3#2.4 TP9.1(TP) U4.11(VCCB) U5.11(VCCB)
P3V3A: C89.2 IC9.8(VCC) J4.D32(3P3VAUX) R57.2 R58.2
P12V: J4.C35(12P0V) J4.C37(12P0V) TP8.1(TP)
VADJ: C92.2 C94.2 J4.E39(VADJ) J4.F40(VADJ) J4.G39(VADJ) J4.H40(VADJ) R62.2 R63.2 TP10.1(TP) U4.1(VCCA) U5.1(VCCA)
1V8_DIS: J4.D26(LA26_P) ; port 1V8_DIS
3V3_APLL_DIS: J4.D23(LA23_P) ; port 3V3_APLL_DIS
3V3_CDR_DIS: J4.D24(LA23_N) ; port 3V3_CDR_DIS
*RST_PSF: J4.G15(LA12_P) ; port *RST_PSF
ADJ_SCL: IC10.22(SCL) J4.D8(LA01_P_CC) R63.1
ADJ_SDA: IC10.23(SDA) J4.D9(LA01_N_CC) R62.1
BEAT_0_N: J4.H8(LA02_N) ; port BEAT_0_N
BEAT_0_P: J4.H7(LA02_P) ; port BEAT_0_P
BEAT_1_N: J4.H26(LA21_N) ; port BEAT_1_N
BEAT_1_P: J4.H25(LA21_P) ; port BEAT_1_P
BEAT_2_N: J4.H20(LA15_N) ; port BEAT_2_N
BEAT_2_P: J4.H19(LA15_P) ; port BEAT_2_P
BEAT_3_N: J4.H14(LA07_N) ; port BEAT_3_N
BEAT_3_P: J4.H13(LA07_P) ; port BEAT_3_P
CDR_LOL_0: U4.9(B2) ; port CDR_LOL_0
CDR_LOL_1: U4.7(B4) ; port CDR_LOL_1
CDR_LOL_2: U5.9(B2) ; port CDR_LOL_2
CDR_LOL_3: U5.7(B4) ; port CDR_LOL_3
CDR_LOS_0: U4.10(B1) ; port CDR_LOS_0
CDR_LOS_1: U4.8(B3) ; port CDR_LOS_1
CDR_LOS_2: U5.10(B1) ; port CDR_LOS_2
CDR_LOS_3: U5.8(B3) ; port CDR_LOS_3
CLK40_N: J4.G19(LA16_N) ; port CLK40_N
CLK40_P: J4.G18(LA16_P) ; port CLK40_P
CLN_RXUSRCLK_N: J4.D5(GBTCLK0_M2C_N) ; port CLN_RXUSRCLK_N
CLN_RXUSRCLK_P: J4.D4(GBTCLK0_M2C_P) ; port CLN_RXUSRCLK_P
DMTD_CLK_FPGA_N: J4.H5(CLK0_M2C_N) ; port DMTD_CLK_FPGA_N
DMTD_CLK_FPGA_P: J4.H4(CLK0_M2C_P) ; port DMTD_CLK_FPGA_P
EQ0_EN: J4.H10(LA04_P) ; port EQ0_EN
EQ1_EN: J4.G10(LA03_N) ; port EQ1_EN
EQ2_EN: J4.G9(LA03_P) ; port EQ2_EN
EQ3_EN: J4.H11(LA04_N) ; port EQ3_EN
FMC_GA0: IC9.2(E1) J4.C34(GA0)
FMC_GA1: IC9.1(E0) J4.D35(GA1)
FMC_SCL: IC9.6(SCL) J4.C30(SCL) R57.1
FMC_SDA: IC9.5(SDA) J4.C31(SDA) R58.1
FPGA_RX0_C_N: C86.1 J4.C7(DP0_M2C_N)
FPGA_RX0_C_P: C85.1 J4.C6(DP0_M2C_P)
FPGA_RX0_N: C86.2 ; port FPGA_RX0_N
FPGA_RX0_P: C85.2 ; port FPGA_RX0_P
FPGA_RX1_C_N: C88.1 J4.A3(DP1_M2C_N)
FPGA_RX1_C_P: C87.1 J4.A2(DP1_M2C_P)
FPGA_RX1_N: C88.2 ; port FPGA_RX1_N
FPGA_RX1_P: C87.2 ; port FPGA_RX1_P
FPGA_TX0_C_N: C82.1 ; port FPGA_TX0_C_N
FPGA_TX0_C_P: C81.1 ; port FPGA_TX0_C_P
FPGA_TX0_N: C82.2 J4.C3(DP0_C2M_N)
FPGA_TX0_P: C81.2 J4.C2(DP0_C2M_P)
FPGA_TX1_C_N: C84.1 ; port FPGA_TX1_C_N
FPGA_TX1_C_P: C83.1 ; port FPGA_TX1_C_P
FPGA_TX1_N: C84.2 J4.A23(DP1_C2M_N)
FPGA_TX1_P: C83.2 J4.A22(DP1_C2M_P)
GT_REFCLK_AUX_N: C96.1 J4.B21(GBTCLK1_M2C_N)
GT_REFCLK_AUX_P: C91.1 J4.B20(GBTCLK1_M2C_P)
LOL_0_ADJ: J4.C15(LA10_N) U4.3(A2)
LOL_1_ADJ: J4.C19(LA14_N) U4.5(A4)
LOL_2_ADJ: J4.D18(LA13_N) U5.3(A2)
LOL_3_ADJ: J4.C23(LA18_N) U5.5(A4)
LOS_0_ADJ: J4.C14(LA10_P) U4.2(A1)
LOS_1_ADJ: J4.C18(LA14_P) U4.4(A3)
LOS_2_ADJ: J4.D17(LA13_P) U5.2(A1)
LOS_3_ADJ: J4.C22(LA18_P) U5.4(A3)
OE_LS: IC10.3(~{RESET}) J4.G16(LA12_N) R64.2 U4.12(OE) U5.12(OE) ; port OE_LS
PLL_Lock: J4.D11(LA05_P) ; port PLL_Lock
PLL_RSTb: J4.D12(LA05_N) ; port PLL_RSTb
RXUSRCLK_N: J4.G7(LA00_N_CC) ; port RXUSRCLK_N
RXUSRCLK_P: J4.G6(LA00_P_CC) ; port RXUSRCLK_P
SCL_CDR_0: IC10.9(SC2) RN1.2 ; port SCL_CDR_0
SCL_CDR_1: IC10.11(SC3) RN1.4 ; port SCL_CDR_1
SCL_CDR_2: IC10.14(SC4) RN2.2 ; port SCL_CDR_2
SCL_CDR_3: IC10.16(SC5) RN2.4 ; port SCL_CDR_3
SCL_PLL: IC10.18(SC6) R61.1 ; port SCL_PLL
SCL_PSC: J4.G22(LA20_N) ; port SCL_PSC
SCL_PSF: J4.G12(LA08_P) ; port SCL_PSF
SCL_SFP_0: IC10.5(SC0) RN3#2.6 ; port SCL_SFP_0  [project net SCL0]
SCL_SFP_1: IC10.7(SC1) RN3#2.8 ; port SCL_SFP_1  [project net SCL1]
SDA_CDR_0: IC10.8(SD2) RN1.1 ; port SDA_CDR_0
SDA_CDR_1: IC10.10(SD3) RN1.3 ; port SDA_CDR_1
SDA_CDR_2: IC10.13(SD4) RN2.1 ; port SDA_CDR_2
SDA_CDR_3: IC10.15(SD5) RN2.3 ; port SDA_CDR_3
SDA_PLL: IC10.17(SD6) R60.1 ; port SDA_PLL
SDA_PSC: J4.G21(LA20_P) ; port SDA_PSC
SDA_PSF: J4.G13(LA08_N) ; port SDA_PSF
SDA_SFP_0: IC10.4(SD0) RN3#2.5 ; port SDA_SFP_0  [project net SDA0]
SDA_SFP_1: IC10.6(SD1) RN3#2.7 ; port SDA_SFP_1  [project net SDA1]
SLOAD_PSC: J4.G24(LA22_P) ; port SLOAD_PSC
SOUT_PSC: J4.G25(LA22_N) ; port SOUT_PSC
NetC91_2: C91.2 J5.1
NetC96_2: C96.2 J6.1
NetIC9_7: IC9.7(~{WC}) R59.2
NetJ4_D30: J4.D30(TDI) J4.D31(TDO)

Not connected (* = marked no-connect by the designer): IC10 19(SD7)* 20(SC7)*; J4 A6(DP2_M2C_P) A7(DP2_M2C_N) A10(DP3_M2C_P) A11(DP3_M2C_N) A14(DP4_M2C_P) A15(DP4_M2C_N) A18(DP5_M2C_P) A19(DP5_M2C_N) A26(DP2_C2M_P) A27(DP2_C2M_N) A30(DP3_C2M_P) A31(DP3_C2M_N) A34(DP4_C2M_P) A35(DP4_C2M_N) A38(DP5_C2M_P) A39(DP5_C2M_N) B1(CLK_DIR) B4(DP9_M2C_P) B5(DP9_M2C_N) B8(DP8_M2C_P) B9(DP8_M2C_N) B12(DP7_M2C_P) B13(DP7_M2C_N) B16(DP6_M2C_P) B17(DP6_M2C_N) B24(DP9_C2M_P) B25(DP9_C2M_N) B28(DP8_C2M_P) B29(DP8_C2M_N) B32(DP7_C2M_P) B33(DP7_C2M_N) B36(DP6_C2M_P) B37(DP6_C2M_N) B40(RES0) C10(LA06_P) C11(LA06_N) C26(LA27_P) C27(LA27_N) D1(PG_C2M) D14(LA09_P) D15(LA09_N) D20(LA17_P_CC) D21(LA17_N_CC) D27(LA26_N) D29(TCK) D33(TMS) D34(TRST_L) E2(HA01_P_CC) E3(HA01_N_CC) E6(HA05_P) E7(HA05_N) E9(HA09_P) E10(HA09_N) E12(HA13_P) E13(HA13_N) E15(HA16_P) E16(HA16_N) E18(HA20_P) E19(HA20_N) E21(HB03_P) E22(HB03_N) E24(HB05_P) E25(HB05_N) E27(HB09_P) E28(HB09_N) E30(HB13_P) E31(HB13_N) E33(HB19_P) E34(HB19_N) E36(HB21_P) E37(HB21_N) F1(PG_M2C) F4(HA00_P_CC) F5(HA00_N_CC) F7(HA04_P) F8(HA04_N) F10(HA08_P) F11(HA08_N) F13(HA12_P) F14(HA12_N) F16(HA15_P) F17(HA15_N) F19(HA19_P) F20(HA19_N) F22(HB02_P) F23(HB02_N) F25(HB04_P) F26(HB04_N) F28(HB08_P) F29(HB08_N) F31(HB12_P) F32(HB12_N) F34(HB16_P) F35(HB16_N) F37(HB20_P) F38(HB20_N) G2(CLK1_M2C_P) G3(CLK1_M2C_N) G27(LA25_P) G28(LA25_N) G30(LA29_P) G31(LA29_N) G33(LA31_P) G34(LA31_N) G36(LA33_P) G37(LA33_N) H1(VREF_A_M2C) H2(PRSNT_M2C_L) H16(LA11_P) H17(LA11_N) H22(LA19_P) H23(LA19_N) H28(LA24_P) H29(LA24_N) H31(LA28_P) H32(LA28_N) H34(LA30_P) H35(LA30_N) H37(LA32_P) H38(LA32_N) I2(CLK3_BIDIR_P) I3(CLK3_BIDIR_N) I6(HA03_P) I7(HA03_N) I9(HA07_P) I10(HA07_N) I12(HA11_P) I13(HA11_N) I15(HA14_P) I16(HA14_N) I18(HA18_P) I19(HA18_N) I21(HA22_P) I22(HA22_N) I24(HB01_P) I25(HB01_N) I27(HB07_P) I28(HB07_N) I30(HB11_P) I31(HB11_N) I33(HB15_P) I34(HB15_N) I36(HB18_P) I37(HB18_N) I39(VIO_B_M2C) J1(VREF_B_M2C) J4(CLK2_BIDIR_P) J5(CLK2_BIDIR_N) J7(HA02_P) J8(HA02_N) J10(HA06_P) J11(HA06_N) J13(HA10_P) J14(HA10_N) J16(HA17_P_CC) J17(HA17_N_CC) J19(HA21_P) J20(HA21_N) J22(HA23_P) J23(HA23_N) J25(HB00_P_CC) J26(HB00_N_CC) J28(HB06_P_CC) J29(HB06_N_CC) J31(HB10_P) J32(HB10_N) J34(HB14_P) J35(HB14_N) J37(HB17_P_CC) J38(HB17_N_CC) J40(VIO_B_M2C)

### Layout directives
differential pair: FPGA_RX0_C_N, FPGA_RX0_C_P, FPGA_RX1_C_N, FPGA_RX1_C_P, FPGA_TX0_N, FPGA_TX0_P, FPGA_TX1_N, FPGA_TX1_P, GT_REFCLK_AUX_N, GT_REFCLK_AUX_P
net class Back-Drill: GT_REFCLK_AUX_N, GT_REFCLK_AUX_P
net class Power: P3V3A, VADJ
net class 50ohm: NetC91_2, NetC96_2

### Notes on the sheet
- (near C89) FMC EPROM
- (near R59) I2C Addr: 10100|E1|E0|
- Level Shifting / Voltage Translator
- (near C90) I2C Mux
- (near RN1) 10kΩ
- (near RN2) 10kΩ
- (near IC10) I2C Addr: 1110111
- (near RN3#2) 10kΩ
- LA00 to LA33 (bancks 43-45 on Virtex) are referenced to VADJ (1.8V)
  GA0, GA1 are grounded. SCL, SDA (bank 64 on Virtex) are referenced to P3V3A
- (near U4) Push-Pull only
- (near U4) Wide logic range (VIHmin=0.65Vcc - VILmax=0.35Vcc)
- (near U5) Push-Pull only
- (near U5) Wide logic range (VIHmin=0.65Vcc - VILmax=0.35Vcc)
- Project/Equipment
- Document
- Designer
- Drawn by
- Check.by
- File
- Last Mod.
- Print Date
- Sheet
- Size
- A3
- of
- Rev

### Library data of the parts
C81-C96 = C0201-100nF-high-density: GRM033R61C104KE14; Vmax: 16V; Value: 100nF
IC9 = M24C02-RMN6TP: Integrated Circuit; Manufacturer_Name: STMicroelectronics; Datasheet Link: http://www.st.com/st-web-ui/static/active/en/resource/technical/document/datasheet/DM00071904.pdf; Height: 1.75mm; Manufacturer_Part_Number: M24C02-RMN6TP; Mouser Part Number: 511-M24C02-RMN6TP; Mouser Price/Stock: https://www.mouser.co.uk/ProductDetail/STMicroelectronics/M24C02-RMN6TP?qs=Jodr3Ka7a6ktinv3aZzndw%3D%3D; Arrow Part Number: M24C02-RMN6TP; Arrow Price/Stock: https://www.arrow.com/en/products/m24c02-rmn6tp/stmicroelectronics?region=nac
IC10 = TCA9548ADGSR: Integrated Circuit; Manufacturer_Name: Texas Instruments; Datasheet Link: https://www.ti.com/lit/ds/symlink/tca9548a.pdf?ts=1738746169750&ref_url=https%253A%252F%252Fwww.mouser.de%252F; Height: 1.1mm; Manufacturer_Part_Number: TCA9548ADGSR; Mouser Part Number: 595-TCA9548ADGSR; Mouser Price/Stock: https://www.mouser.co.uk/ProductDetail/Texas-Instruments/TCA9548ADGSR?qs=olJun0bQHM%252B7USbLxm4jDw%3D%3D; Arrow Part Number: TCA9548ADGSR; Arrow Price/Stock: https://www.arrow.com/en/products/tca9548adgsr/texas-instruments?utm_currency=USD&region=nac
J4 = SEAM-40-03.5-S-10-2-A-K-TR: MF: Samtec; Value: *; Package: None; Price: None; MP: SEAM-40-03.5-S-10-2-A-K-TR; Availability: Unavailable
J5 J6 = SAMTEC_SMA-J-P-H-ST-MT1: as J7 on sheet PLL; Part Number: SAMTEC_SMA-J-P-H-ST-MT1; Component Kind: Standard; Component Type: Standard; Pin Count: 5; Family: SMA; Mounted: Yes; Socket: No; SMD: Yes; Sense: Yes; Status: Not Recommended; Manufacturer Part Number: SMA-J-P-H-ST-MT1; ComponentHeight: 7.95mm; HelpURL: \\cern.ch\dfs\Applications\Altium\Datasheets\SAMTEC_SMA-J-P-H-ST-MT1.pdf; Author: CERN DEM HF; CreateDate: 5/24/2023; LatestRevisionDate: 5/24/2023
R57-R64 = R0201-100ohm-high-density: Resistor 10k; Value: 100Ω
RN1 RN2 RN3#2 = EXB-U18103JX: Resistor Network (8-Pin) 10k; Manufacturer_Name: Panasonic; Datasheet Link: https://industrial.panasonic.com/cdbs/www-data/pdf/AOC0000/AOC0000C20.pdf; Height: 0.45mm; Manufacturer_Part_Number: EXB-U18103JX; Mouser Part Number: 667-EXB-U18103JX; Mouser Price/Stock: https://www.mouser.com/Search/Refine.aspx?Keyword=667-EXB-U18103JX
TP8-TP10 = RCU-0C: as TP11 on sheet PLL; Package: None; Price: None; Value: *; MP: RCU-0C; Availability: Unavailable
U4 U5 = TXB0104RUTR: No Description Available; Mfr_Name: Texas Instruments; RefDes: RefDes; Type: Type